# Altium project S7CAS-PLEIADES-CARTE-MERE_P06.PrjPcb (part 3 of 4)

## Sheet S7CAS-PLEIADES-CARTE-MERE_P06_DDR3.SCHDOC
size Tabloid; SheetNumber: 12; SheetTotal: 18; Sheet_Name: DDR3; Size: 11x17
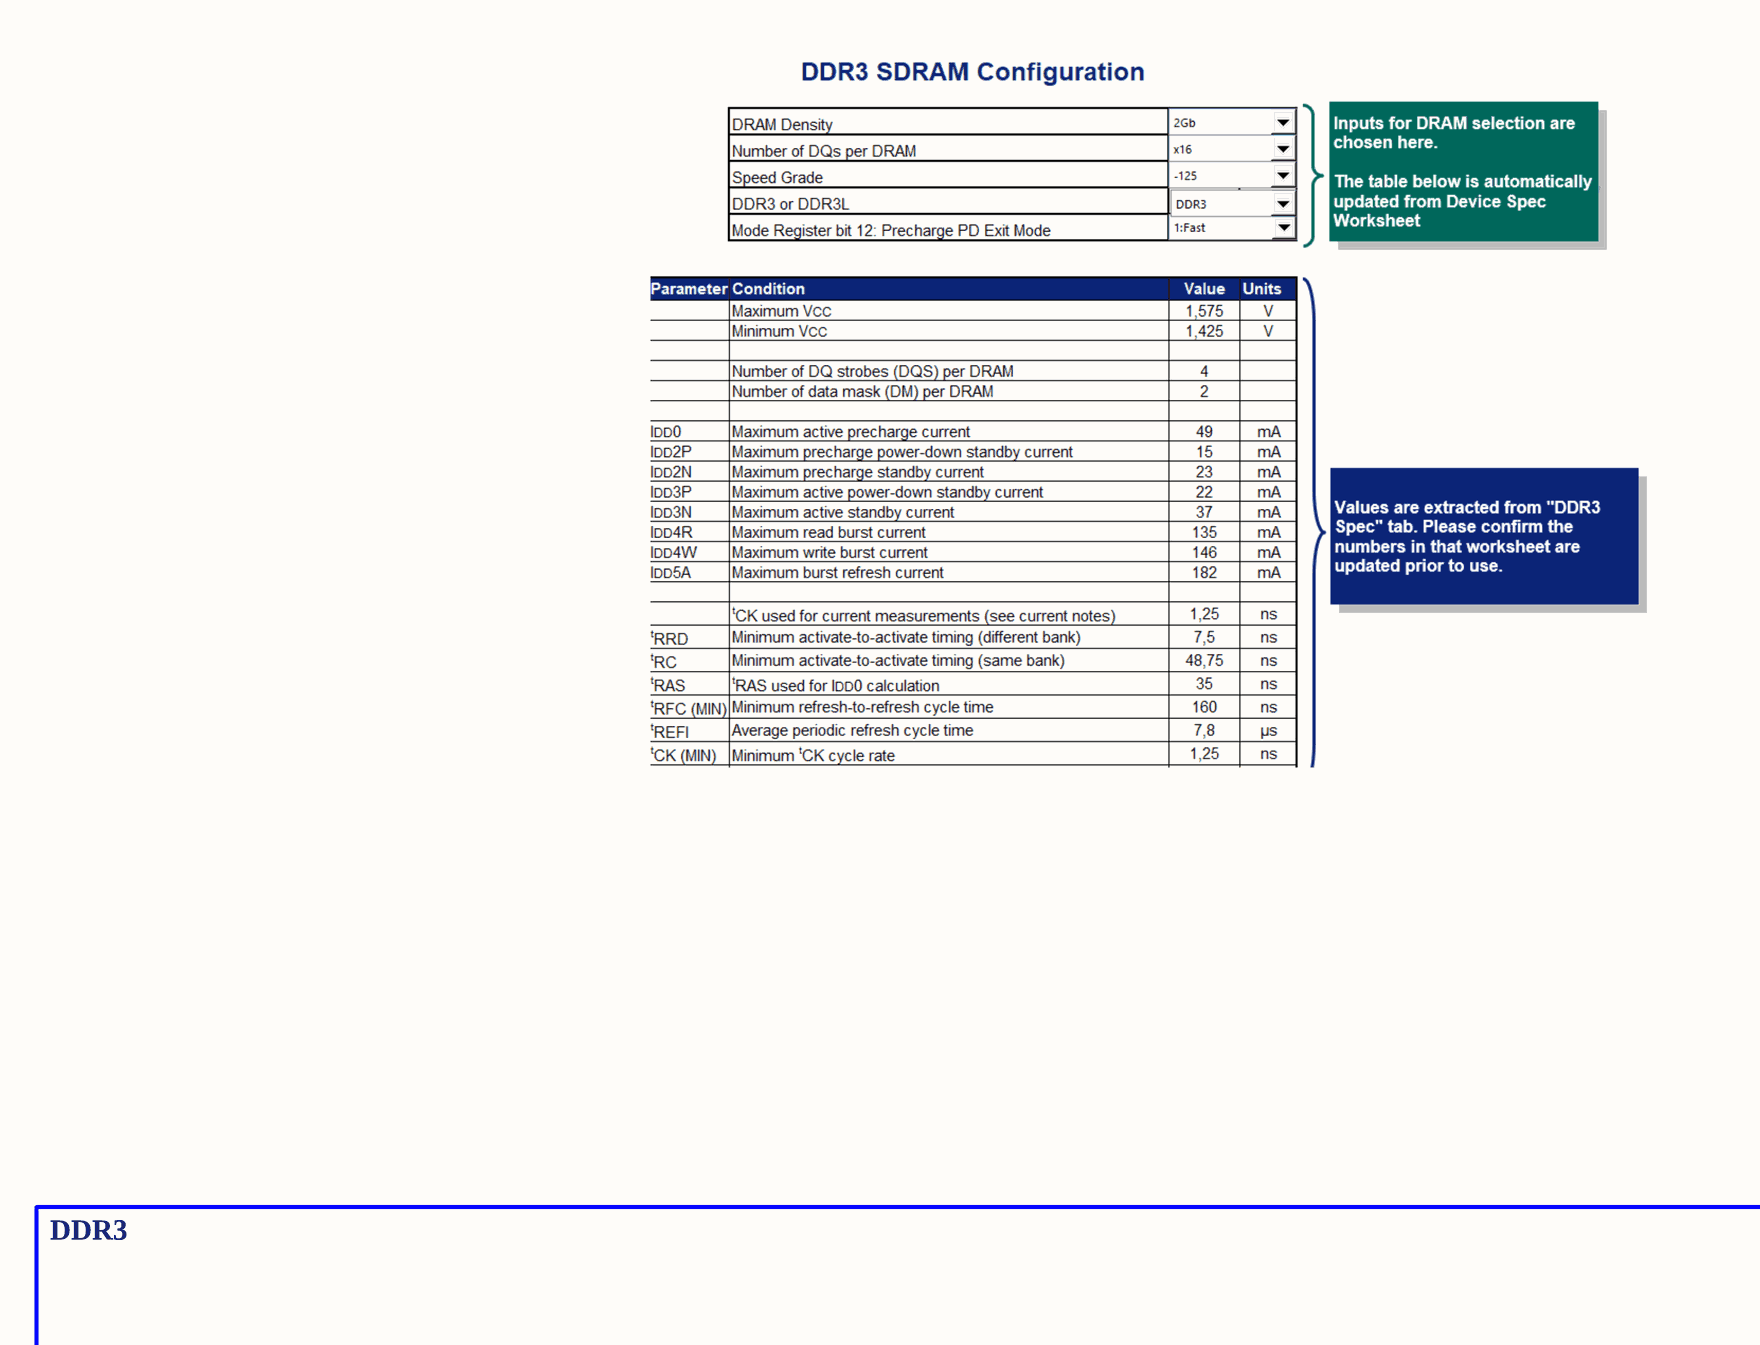
[diagram p34: S7CAS-PLEIADES-CARTE-MERE_P06_DDR3.SCHDOC, top left]
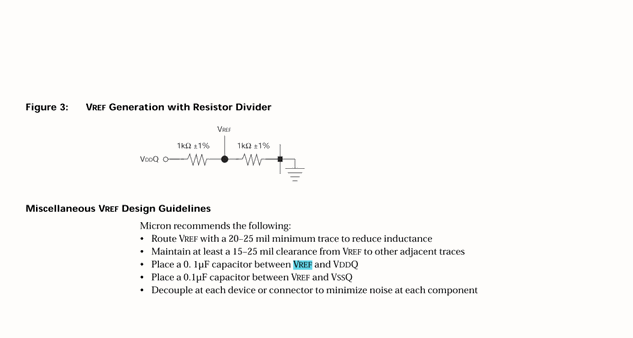
[diagram p35: S7CAS-PLEIADES-CARTE-MERE_P06_DDR3.SCHDOC, top right]
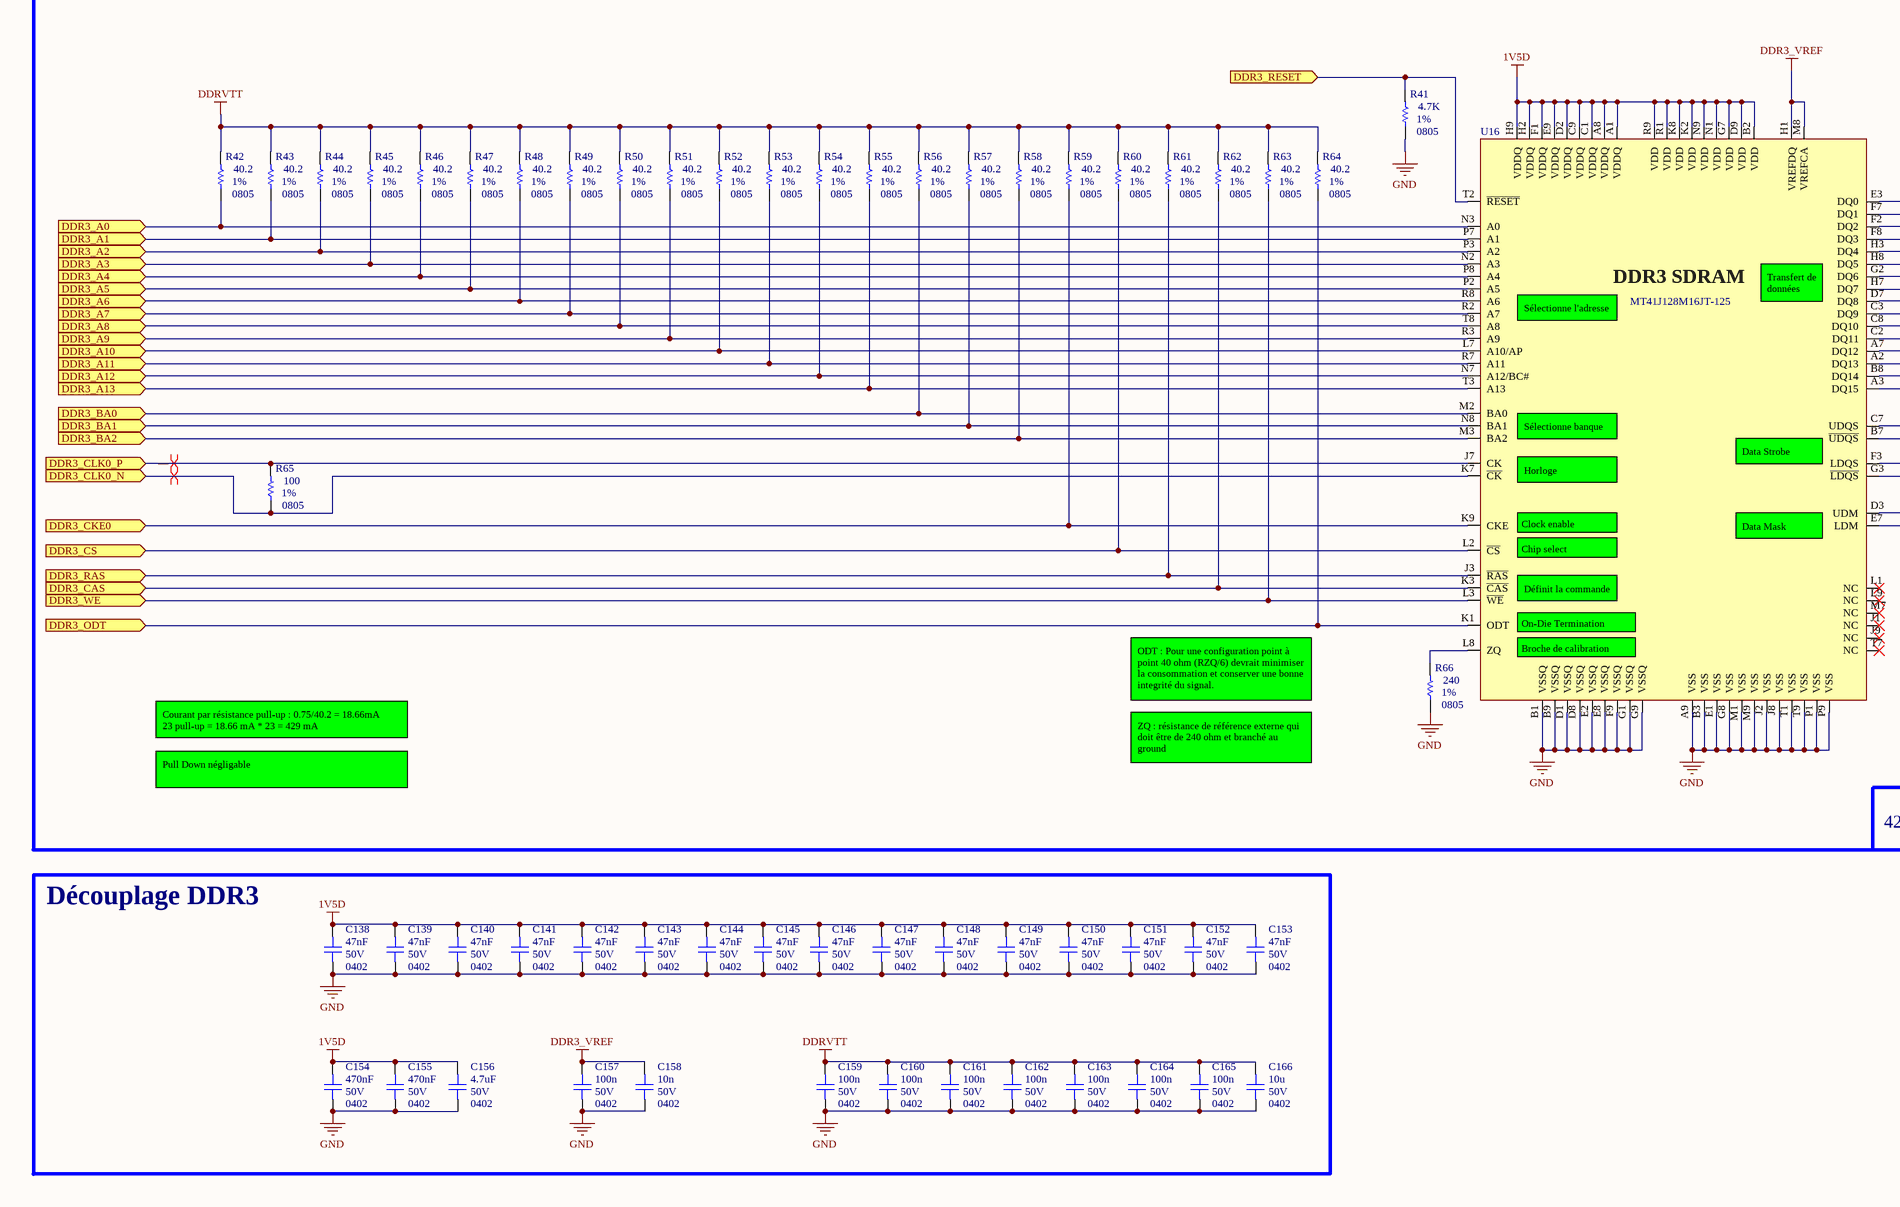
[diagram p36: S7CAS-PLEIADES-CARTE-MERE_P06_DDR3.SCHDOC, bottom left]
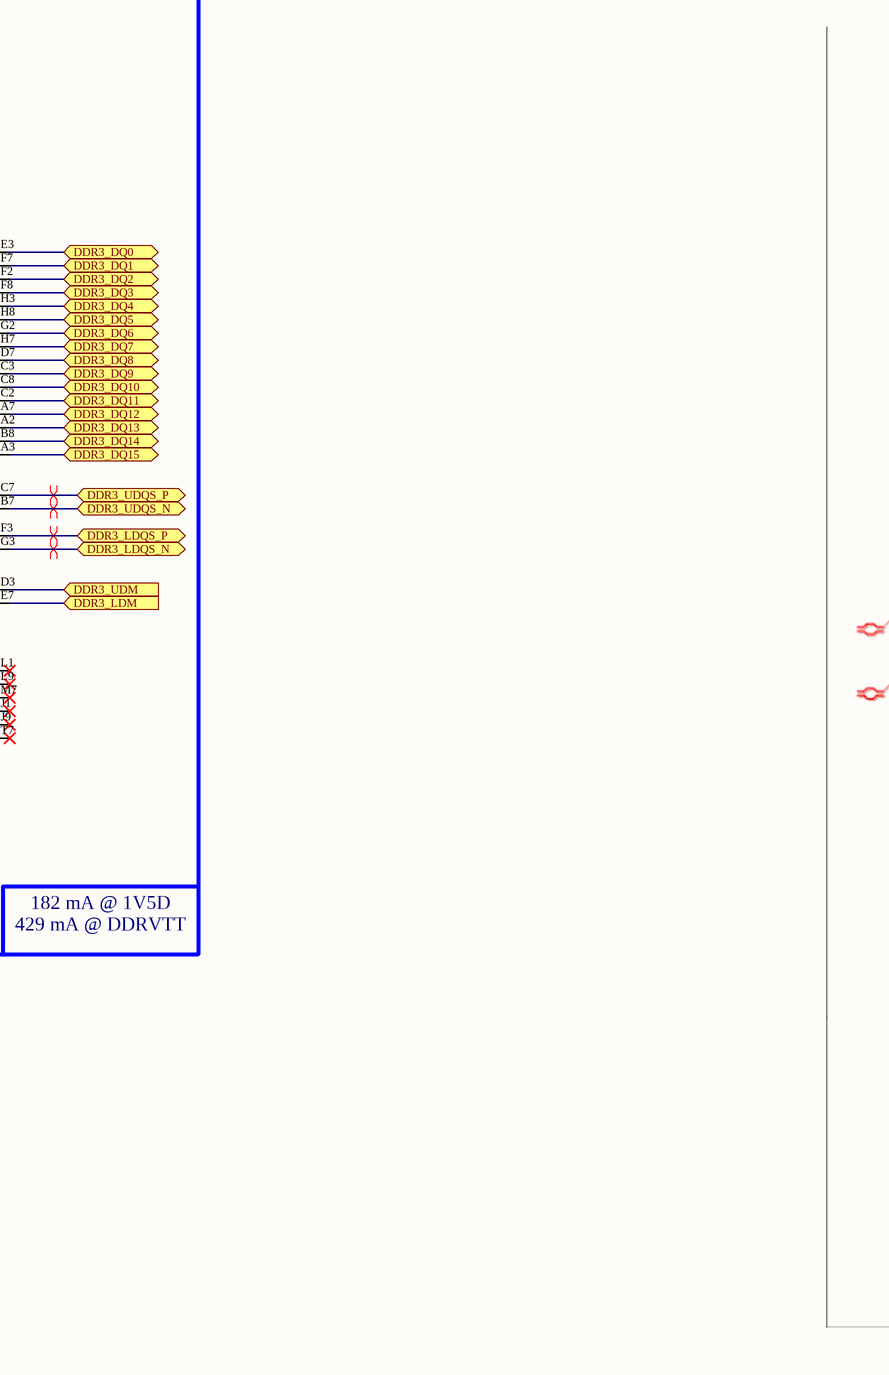
[diagram p37: S7CAS-PLEIADES-CARTE-MERE_P06_DDR3.SCHDOC, bottom middle]
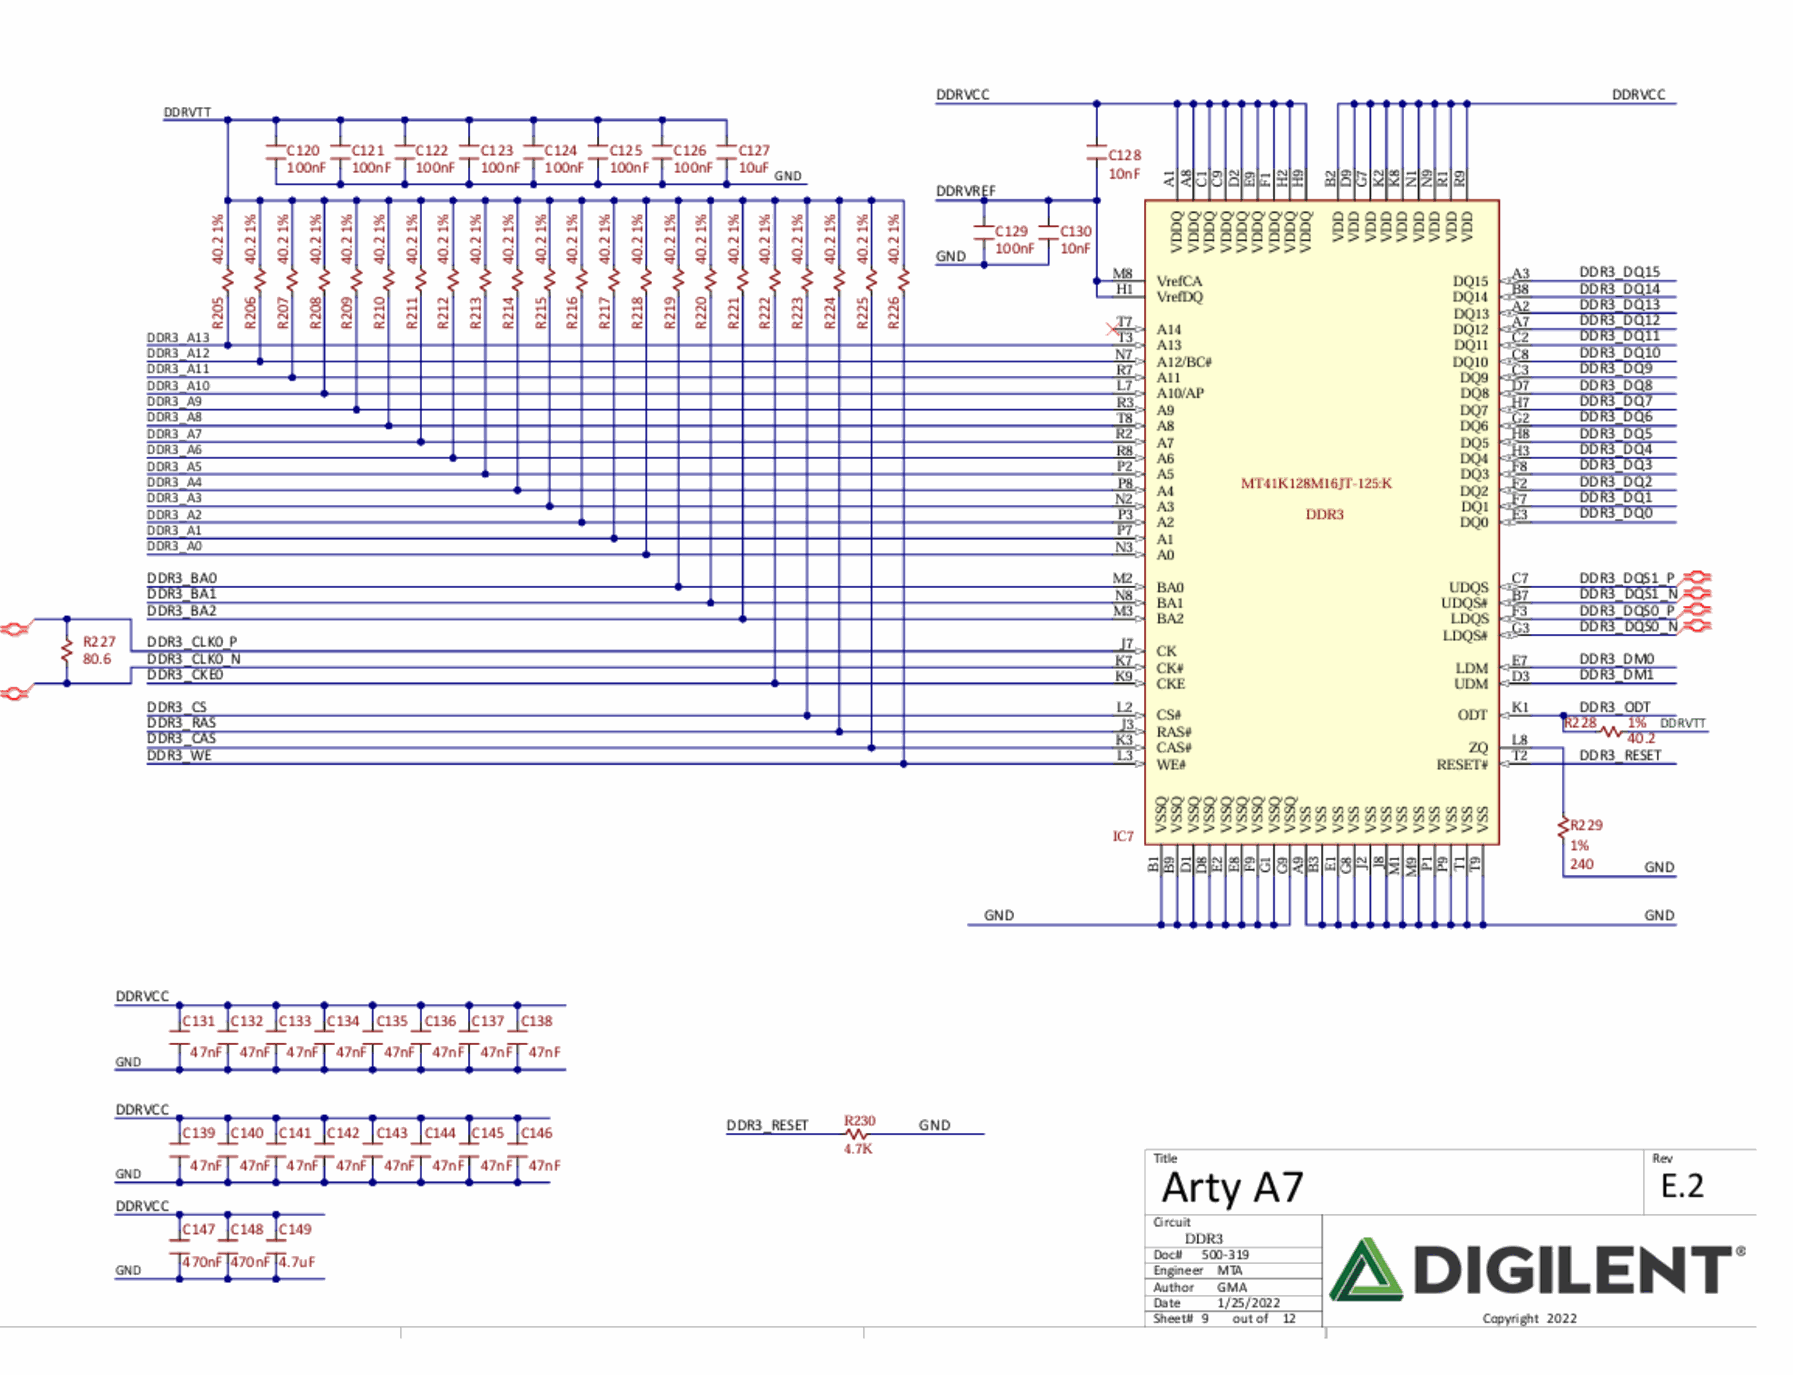
[diagram p38: S7CAS-PLEIADES-CARTE-MERE_P06_DDR3.SCHDOC, bottom right]

### Parts
C138  value 47nF  Voltage: 50V  Package: 0402  [CAP_0402]  (hidden comment: CAP - 0402)
C139  value 47nF  Voltage: 50V  Package: 0402  [CAP_0402]  (hidden comment: CAP - 0402)
C140  value 47nF  Voltage: 50V  Package: 0402  [CAP_0402]  (hidden comment: CAP - 0402)
C141  value 47nF  Voltage: 50V  Package: 0402  [CAP_0402]  (hidden comment: CAP - 0402)
C142  value 47nF  Voltage: 50V  Package: 0402  [CAP_0402]  (hidden comment: CAP - 0402)
C143  value 47nF  Voltage: 50V  Package: 0402  [CAP_0402]  (hidden comment: CAP - 0402)
C144  value 47nF  Voltage: 50V  Package: 0402  [CAP_0402]  (hidden comment: CAP - 0402)
C145  value 47nF  Voltage: 50V  Package: 0402  [CAP_0402]  (hidden comment: CAP - 0402)
C146  value 47nF  Voltage: 50V  Package: 0402  [CAP_0402]  (hidden comment: CAP - 0402)
C147  value 47nF  Voltage: 50V  Package: 0402  [CAP_0402]  (hidden comment: CAP - 0402)
C148  value 47nF  Voltage: 50V  Package: 0402  [CAP_0402]  (hidden comment: CAP - 0402)
C149  value 47nF  Voltage: 50V  Package: 0402  [CAP_0402]  (hidden comment: CAP - 0402)
C150  value 47nF  Voltage: 50V  Package: 0402  [CAP_0402]  (hidden comment: CAP - 0402)
C151  value 47nF  Voltage: 50V  Package: 0402  [CAP_0402]  (hidden comment: CAP - 0402)
C152  value 47nF  Voltage: 50V  Package: 0402  [CAP_0402]  (hidden comment: CAP - 0402)
C153  value 47nF  Voltage: 50V  Package: 0402  [CAP_0402]  (hidden comment: CAP - 0402)
C154  value 470nF  Voltage: 50V  Package: 0402  [CAP_0402]  (hidden comment: CAP - 0402)
C155  value 470nF  Voltage: 50V  Package: 0402  [CAP_0402]  (hidden comment: CAP - 0402)
C156  value 4.7uF  Voltage: 50V  Package: 0402  [CAP_0402]  (hidden comment: CAP - 0402)
C157  value 100n  Voltage: 50V  Package: 0402  [CAP_0402]  (hidden comment: CAP - 0402)
C158  value 10n  Voltage: 50V  Package: 0402  [CAP_0402]  (hidden comment: CAP - 0402)
C159  value 100n  Voltage: 50V  Package: 0402  [CAP_0402]  (hidden comment: CAP - 0402)
C160  value 100n  Voltage: 50V  Package: 0402  [CAP_0402]  (hidden comment: CAP - 0402)
C161  value 100n  Voltage: 50V  Package: 0402  [CAP_0402]  (hidden comment: CAP - 0402)
C162  value 100n  Voltage: 50V  Package: 0402  [CAP_0402]  (hidden comment: CAP - 0402)
C163  value 100n  Voltage: 50V  Package: 0402  [CAP_0402]  (hidden comment: CAP - 0402)
C164  value 100n  Voltage: 50V  Package: 0402  [CAP_0402]  (hidden comment: CAP - 0402)
C165  value 100n  Voltage: 50V  Package: 0402  [CAP_0402]  (hidden comment: CAP - 0402)
C166  value 10u  Voltage: 50V  Package: 0402  [CAP_0402]  (hidden comment: CAP - 0402)
R41  value 4.7K  Package: 0805  Precision: 1%  [RES_0805]  (hidden comment: RES - 0805)
R42  value 40.2  Package: 0805  Precision: 1%  [RES_0805]  (hidden comment: RES - 0805)
R43  value 40.2  Package: 0805  Precision: 1%  [RES_0805]  (hidden comment: RES - 0805)
R44  value 40.2  Package: 0805  Precision: 1%  [RES_0805]  (hidden comment: RES - 0805)
R45  value 40.2  Package: 0805  Precision: 1%  [RES_0805]  (hidden comment: RES - 0805)
R46  value 40.2  Package: 0805  Precision: 1%  [RES_0805]  (hidden comment: RES - 0805)
R47  value 40.2  Package: 0805  Precision: 1%  [RES_0805]  (hidden comment: RES - 0805)
R48  value 40.2  Package: 0805  Precision: 1%  [RES_0805]  (hidden comment: RES - 0805)
R49  value 40.2  Package: 0805  Precision: 1%  [RES_0805]  (hidden comment: RES - 0805)
R50  value 40.2  Package: 0805  Precision: 1%  [RES_0805]  (hidden comment: RES - 0805)
R51  value 40.2  Package: 0805  Precision: 1%  [RES_0805]  (hidden comment: RES - 0805)
R52  value 40.2  Package: 0805  Precision: 1%  [RES_0805]  (hidden comment: RES - 0805)
R53  value 40.2  Package: 0805  Precision: 1%  [RES_0805]  (hidden comment: RES - 0805)
R54  value 40.2  Package: 0805  Precision: 1%  [RES_0805]  (hidden comment: RES - 0805)
R55  value 40.2  Package: 0805  Precision: 1%  [RES_0805]  (hidden comment: RES - 0805)
R56  value 40.2  Package: 0805  Precision: 1%  [RES_0805]  (hidden comment: RES - 0805)
R57  value 40.2  Package: 0805  Precision: 1%  [RES_0805]  (hidden comment: RES - 0805)
R58  value 40.2  Package: 0805  Precision: 1%  [RES_0805]  (hidden comment: RES - 0805)
R59  value 40.2  Package: 0805  Precision: 1%  [RES_0805]  (hidden comment: RES - 0805)
R60  value 40.2  Package: 0805  Precision: 1%  [RES_0805]  (hidden comment: RES - 0805)
R61  value 40.2  Package: 0805  Precision: 1%  [RES_0805]  (hidden comment: RES - 0805)
R62  value 40.2  Package: 0805  Precision: 1%  [RES_0805]  (hidden comment: RES - 0805)
R63  value 40.2  Package: 0805  Precision: 1%  [RES_0805]  (hidden comment: RES - 0805)
R64  value 40.2  Package: 0805  Precision: 1%  [RES_0805]  (hidden comment: RES - 0805)
R65  value 100  Package: 0805  Precision: 1%  [RES_0805]  (hidden comment: RES - 0805)
R66  value 240  Package: 0805  Precision: 1%  [RES_0805]  (hidden comment: RES - 0805)
U16  MT41J128M16JT-125  [MEM_DDR3_MT41J128M16JT-125]

### Blocks framed on the sheet
DDR3: R41-R66 U16
Découplage DDR3: C138-C166

### Ports
DDR3_A0 (in, see S7CAS-PLEIADES-CARTE-MERE_P06_FPGA2[6B]), DDR3_A1 (in, see S7CAS-PLEIADES-CARTE-MERE_P06_FPGA2[6B]), DDR3_A2 (in, see S7CAS-PLEIADES-CARTE-MERE_P06_FPGA2[6B]), DDR3_A3 (in, see S7CAS-PLEIADES-CARTE-MERE_P06_FPGA2[6B]), DDR3_A4 (in, see S7CAS-PLEIADES-CARTE-MERE_P06_FPGA2[6B]), DDR3_A5 (in, see S7CAS-PLEIADES-CARTE-MERE_P06_FPGA2[6B]), DDR3_A6 (in, see S7CAS-PLEIADES-CARTE-MERE_P06_FPGA2[6B]), DDR3_A7 (in, see S7CAS-PLEIADES-CARTE-MERE_P06_FPGA2[6B]), DDR3_A8 (in, see S7CAS-PLEIADES-CARTE-MERE_P06_FPGA2[6B]), DDR3_A9 (in, see S7CAS-PLEIADES-CARTE-MERE_P06_FPGA2[6B]), DDR3_A10 (in, see S7CAS-PLEIADES-CARTE-MERE_P06_FPGA2[6B]), DDR3_A11 (in, see S7CAS-PLEIADES-CARTE-MERE_P06_FPGA2[6C]), DDR3_A12 (in, see S7CAS-PLEIADES-CARTE-MERE_P06_FPGA2[6C]), DDR3_A13 (in, see S7CAS-PLEIADES-CARTE-MERE_P06_FPGA2[6C]), DDR3_BA0 (in, see S7CAS-PLEIADES-CARTE-MERE_P06_FPGA2[6B]), DDR3_BA1 (in, see S7CAS-PLEIADES-CARTE-MERE_P06_FPGA2[6B]), DDR3_BA2 (in, see S7CAS-PLEIADES-CARTE-MERE_P06_FPGA2[6B]), DDR3_CAS (in, see S7CAS-PLEIADES-CARTE-MERE_P06_FPGA2[6B]), DDR3_CKE0 (in, see S7CAS-PLEIADES-CARTE-MERE_P06_FPGA2[6B]), DDR3_CLK0_N (in, see S7CAS-PLEIADES-CARTE-MERE_P06_FPGA2[6B]), DDR3_CLK0_P (in, see S7CAS-PLEIADES-CARTE-MERE_P06_FPGA2[6B]), DDR3_CS (in, see S7CAS-PLEIADES-CARTE-MERE_P06_FPGA2[6C]), DDR3_DQ0 (bidir, see S7CAS-PLEIADES-CARTE-MERE_P06_FPGA2[6A]), DDR3_DQ1 (bidir, see S7CAS-PLEIADES-CARTE-MERE_P06_FPGA2[6A]), DDR3_DQ2 (bidir, see S7CAS-PLEIADES-CARTE-MERE_P06_FPGA2[6A]), DDR3_DQ3 (bidir, see S7CAS-PLEIADES-CARTE-MERE_P06_FPGA2[6A]), DDR3_DQ4 (bidir, see S7CAS-PLEIADES-CARTE-MERE_P06_FPGA2[6B]), DDR3_DQ5 (bidir, see S7CAS-PLEIADES-CARTE-MERE_P06_FPGA2[6B]), DDR3_DQ6 (bidir, see S7CAS-PLEIADES-CARTE-MERE_P06_FPGA2[6B]), DDR3_DQ7 (bidir, see S7CAS-PLEIADES-CARTE-MERE_P06_FPGA2[6B]), DDR3_DQ8 (bidir, see S7CAS-PLEIADES-CARTE-MERE_P06_FPGA2[6A]), DDR3_DQ9 (bidir, see S7CAS-PLEIADES-CARTE-MERE_P06_FPGA2[6A]), DDR3_DQ10 (bidir, see S7CAS-PLEIADES-CARTE-MERE_P06_FPGA2[6A]), DDR3_DQ11 (bidir, see S7CAS-PLEIADES-CARTE-MERE_P06_FPGA2[6A]), DDR3_DQ12 (bidir, see S7CAS-PLEIADES-CARTE-MERE_P06_FPGA2[6A]), DDR3_DQ13 (bidir, see S7CAS-PLEIADES-CARTE-MERE_P06_FPGA2[6A]), DDR3_DQ14 (bidir, see S7CAS-PLEIADES-CARTE-MERE_P06_FPGA2[4C]), DDR3_DQ15 (bidir, see S7CAS-PLEIADES-CARTE-MERE_P06_FPGA2[6A]), DDR3_LDM (in, see S7CAS-PLEIADES-CARTE-MERE_P06_FPGA2[6B]), DDR3_LDQS_N (bidir, see S7CAS-PLEIADES-CARTE-MERE_P06_FPGA2[6B]), DDR3_LDQS_P (bidir, see S7CAS-PLEIADES-CARTE-MERE_P06_FPGA2[6A]), DDR3_ODT (in, see S7CAS-PLEIADES-CARTE-MERE_P06_FPGA2[6B]), DDR3_RAS (in, see S7CAS-PLEIADES-CARTE-MERE_P06_FPGA2[6B]), DDR3_RESET (in, see S7CAS-PLEIADES-CARTE-MERE_P06_FPGA2[6C]), DDR3_UDM (in, see S7CAS-PLEIADES-CARTE-MERE_P06_FPGA2[6B]), DDR3_UDQS_N (bidir, see S7CAS-PLEIADES-CARTE-MERE_P06_FPGA2[6A]), DDR3_UDQS_P (bidir, see S7CAS-PLEIADES-CARTE-MERE_P06_FPGA2[6A]), DDR3_WE (in, see S7CAS-PLEIADES-CARTE-MERE_P06_FPGA2[6B])

### Nets
1V5D: C138.2 C139.2 C140.2 C141.2 C142.2 C143.2 C144.2 C145.2 C146.2 C147.2 C148.2 C149.2 C150.2 C151.2 C152.2 C153.2 C154.2 C155.2 C156.2 U16.A1(VDDQ) U16.A8(VDDQ) U16.B2(VDD) U16.C1(VDDQ) U16.C9(VDDQ) U16.D2(VDDQ) U16.D9(VDD) U16.E9(VDDQ) U16.F1(VDDQ) U16.G7(VDD) U16.H2(VDDQ) U16.H9(VDDQ) U16.K2(VDD) U16.K8(VDD) U16.N1(VDD) U16.N9(VDD) U16.R1(VDD) U16.R9(VDD)
DDR3_VREF: C157.2 C158.2 U16.H1(VREFDQ) U16.M8(VREFCA)
DDRVTT: C159.2 C160.2 C161.2 C162.2 C163.2 C164.2 C165.2 C166.2 R42.2 R43.2 R44.2 R45.2 R46.2 R47.2 R48.2 R49.2 R50.2 R51.2 R52.2 R53.2 R54.2 R55.2 R56.2 R57.2 R58.2 R59.2 R60.2 R61.2 R62.2 R63.2 R64.2
GND: C138.1 C139.1 C140.1 C141.1 C142.1 C143.1 C144.1 C145.1 C146.1 C147.1 C148.1 C149.1 C150.1 C151.1 C152.1 C153.1 C154.1 C155.1 C156.1 C157.1 C158.1 C159.1 C160.1 C161.1 C162.1 C163.1 C164.1 C165.1 C166.1 R41.1 R66.1 U16.A9(VSS) U16.B1(VSSQ) U16.B3(VSS) U16.B9(VSSQ) U16.D1(VSSQ) U16.D8(VSSQ) U16.E1(VSS) U16.E2(VSSQ) U16.E8(VSSQ) U16.F9(VSSQ) U16.G1(VSSQ) U16.G8(VSS) U16.G9(VSSQ) U16.J2(VSS) U16.J8(VSS) U16.M1(VSS) U16.M9(VSS) U16.P1(VSS) U16.P9(VSS) U16.T1(VSS) U16.T9(VSS)
DDR3_A0: R42.1 U16.N3(A0) ; port DDR3_A0
DDR3_A1: R43.1 U16.P7(A1) ; port DDR3_A1
DDR3_A2: R44.1 U16.P3(A2) ; port DDR3_A2
DDR3_A3: R45.1 U16.N2(A3) ; port DDR3_A3
DDR3_A4: R46.1 U16.P8(A4) ; port DDR3_A4
DDR3_A5: R47.1 U16.P2(A5) ; port DDR3_A5
DDR3_A6: R48.1 U16.R8(A6) ; port DDR3_A6
DDR3_A7: R49.1 U16.R2(A7) ; port DDR3_A7
DDR3_A8: R50.1 U16.T8(A8) ; port DDR3_A8
DDR3_A9: R51.1 U16.R3(A9) ; port DDR3_A9
DDR3_A10: R52.1 U16.L7(A10/AP) ; port DDR3_A10
DDR3_A11: R53.1 U16.R7(A11) ; port DDR3_A11
DDR3_A12: R54.1 U16.N7(A12/BC#) ; port DDR3_A12
DDR3_A13: R55.1 U16.T3(A13) ; port DDR3_A13
DDR3_BA0: R56.1 U16.M2(BA0) ; port DDR3_BA0
DDR3_BA1: R57.1 U16.N8(BA1) ; port DDR3_BA1
DDR3_BA2: R58.1 U16.M3(BA2) ; port DDR3_BA2
DDR3_CAS: R62.1 U16.K3(~{CAS}) ; port DDR3_CAS
DDR3_CKE0: R59.1 U16.K9(CKE) ; port DDR3_CKE0
DDR3_CLK0_N: R65.1 U16.K7(~{CK}) ; port DDR3_CLK0_N
DDR3_CLK0_P: R65.2 U16.J7(CK) ; port DDR3_CLK0_P
DDR3_CS: R60.1 U16.L2(~{CS}) ; port DDR3_CS
DDR3_DQ0: U16.E3(DQ0) ; port DDR3_DQ0
DDR3_DQ1: U16.F7(DQ1) ; port DDR3_DQ1
DDR3_DQ2: U16.F2(DQ2) ; port DDR3_DQ2
DDR3_DQ3: U16.F8(DQ3) ; port DDR3_DQ3
DDR3_DQ4: U16.H3(DQ4) ; port DDR3_DQ4
DDR3_DQ5: U16.H8(DQ5) ; port DDR3_DQ5
DDR3_DQ6: U16.G2(DQ6) ; port DDR3_DQ6
DDR3_DQ7: U16.H7(DQ7) ; port DDR3_DQ7
DDR3_DQ8: U16.D7(DQ8) ; port DDR3_DQ8
DDR3_DQ9: U16.C3(DQ9) ; port DDR3_DQ9
DDR3_DQ10: U16.C8(DQ10) ; port DDR3_DQ10
DDR3_DQ11: U16.C2(DQ11) ; port DDR3_DQ11
DDR3_DQ12: U16.A7(DQ12) ; port DDR3_DQ12
DDR3_DQ13: U16.A2(DQ13) ; port DDR3_DQ13
DDR3_DQ14: U16.B8(DQ14) ; port DDR3_DQ14
DDR3_DQ15: U16.A3(DQ15) ; port DDR3_DQ15
DDR3_LDM: U16.E7(LDM) ; port DDR3_LDM
DDR3_LDQS_N: U16.G3(~{LDQS}) ; port DDR3_LDQS_N
DDR3_LDQS_P: U16.F3(LDQS) ; port DDR3_LDQS_P
DDR3_ODT: R64.1 U16.K1(ODT) ; port DDR3_ODT
DDR3_RAS: R61.1 U16.J3(~{RAS}) ; port DDR3_RAS
DDR3_RESET: R41.2 U16.T2(~{RESET}) ; port DDR3_RESET
DDR3_UDM: U16.D3(UDM) ; port DDR3_UDM
DDR3_UDQS_N: U16.B7(~{UDQS}) ; port DDR3_UDQS_N
DDR3_UDQS_P: U16.C7(UDQS) ; port DDR3_UDQS_P
DDR3_WE: R63.1 U16.L3(~{WE}) ; port DDR3_WE
NetR66_2: R66.2 U16.L8(ZQ)

Not connected (* = marked no-connect by the designer): U16 J1(NC)* J9(NC)* L1(NC)* L9(NC)* M7(NC)* T7(NC)*

### Layout directives
differential pair: DDR3_CLK0_N, DDR3_CLK0_P, DDR3_LDQS_N, DDR3_LDQS_P, DDR3_UDQS_N, DDR3_UDQS_P

### Notes on the sheet
- (near U16) Transfert de données
- (near U16) Sélectionne l'adresse
- (near U16) Sélectionne banque
- (near U16) Horloge
- (near U16) Data Strobe
- (near U16) Clock enable
- (near U16) Chip select
- (near U16) Data Mask
- (near U16) Définit la commande
- (near U16) On-Die Termination
- (near U16) Broche de calibration externe
- Courant par résistance pull-up : 0.75/40.2 = 18.66mA
  23 pull-up = 18.66 mA * 23 = 429 mA
- ODT : Pour une configuration point à point 40 ohm (RZQ/6) devrait minimiser la consommation et conserver une bonne integrité du signal.
- Pull Down négligable
- ZQ : résistance de référence externe qui doit être de 240 ohm et branché au ground
- 182 mA @ 1V5D
  429 mA @ DDRVTT
- Sheet Name
- Project Title
- Global Project
- Size
- Group
- Revision
- Date
- Sheet
- of
- Filename
- Designers
- (in symbol MEM_DDR3_MT41J128M16JT-125:K TR) DDR3 SDRAM

### Library data of the parts
C138-C166 = CAP - 0402: Precision: 10%; Current: *; CreatedBy: Jonathan Bouchard; Power: *
U16 = MEM_DDR3_MT41J128M16JT-125:K TR: MEM - DDR3 SDRAM 2GBIT 800MHZ - TFBGA-96; Voltage: 1.425 V ~ 1.575 V; Mfg: Micrel; Current: *; Power: *; Mfg Part Number: MT41J128M16JT-125; HelpURL: http://www.micron.com/~/media/Documents/Products/Data%20Sheet/DRAM/DDR3/2Gb_DDR3_SDRAM.pdf; CreatedBy: Jonathan Bouchard; Temperature: 0°C ~ 95°C (TC); Value: *; Precision: *; Package: TFBGA-96; Supplier 1: Digikey; Supplier Part Number 1: 557-1611-1-ND
R41-R66 = RES - 0805: Current: *; CreatedBy: Jonathan Bouchard

## Sheet S7CAS-PLEIADES-CARTE-MERE_P06_MOTOR.SCHDOC
size Tabloid; SheetNumber: 13; SheetTotal: 18; Sheet_Name: MOTOR; Size: 11x17
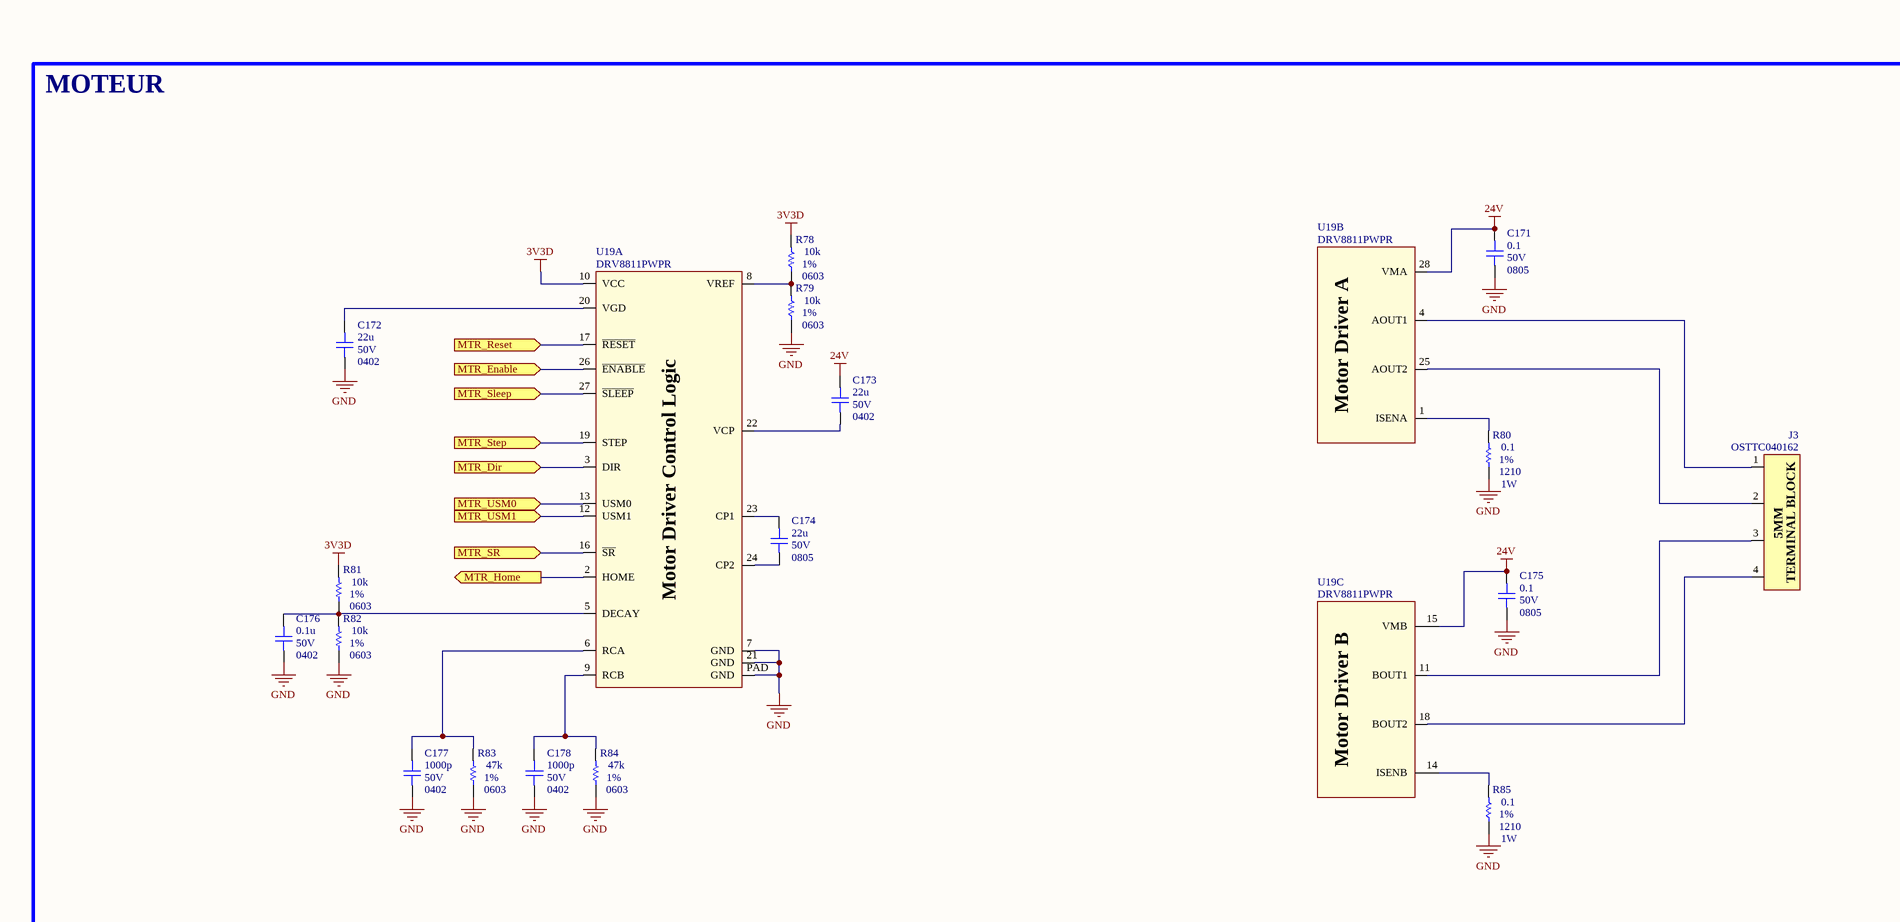
[diagram p39: S7CAS-PLEIADES-CARTE-MERE_P06_MOTOR.SCHDOC, top left]
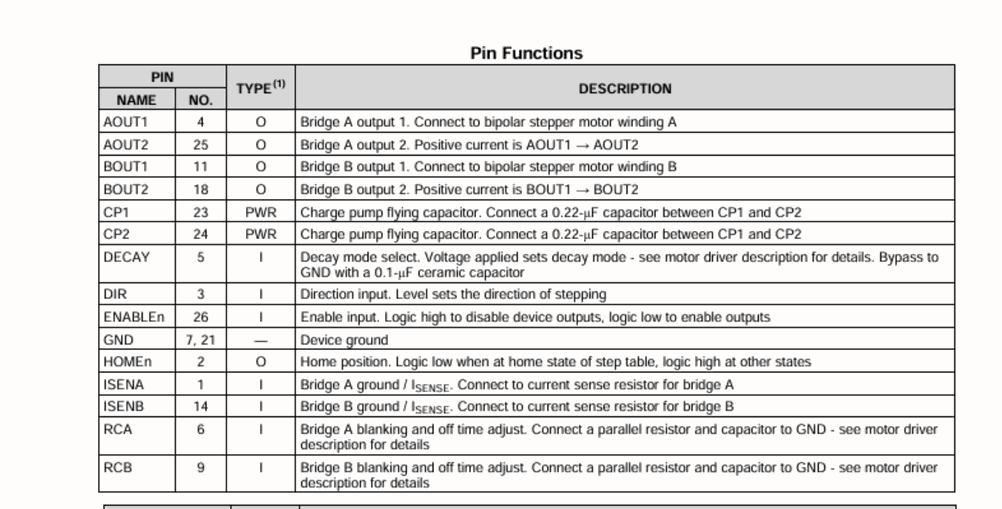
[diagram p40: S7CAS-PLEIADES-CARTE-MERE_P06_MOTOR.SCHDOC, top right]
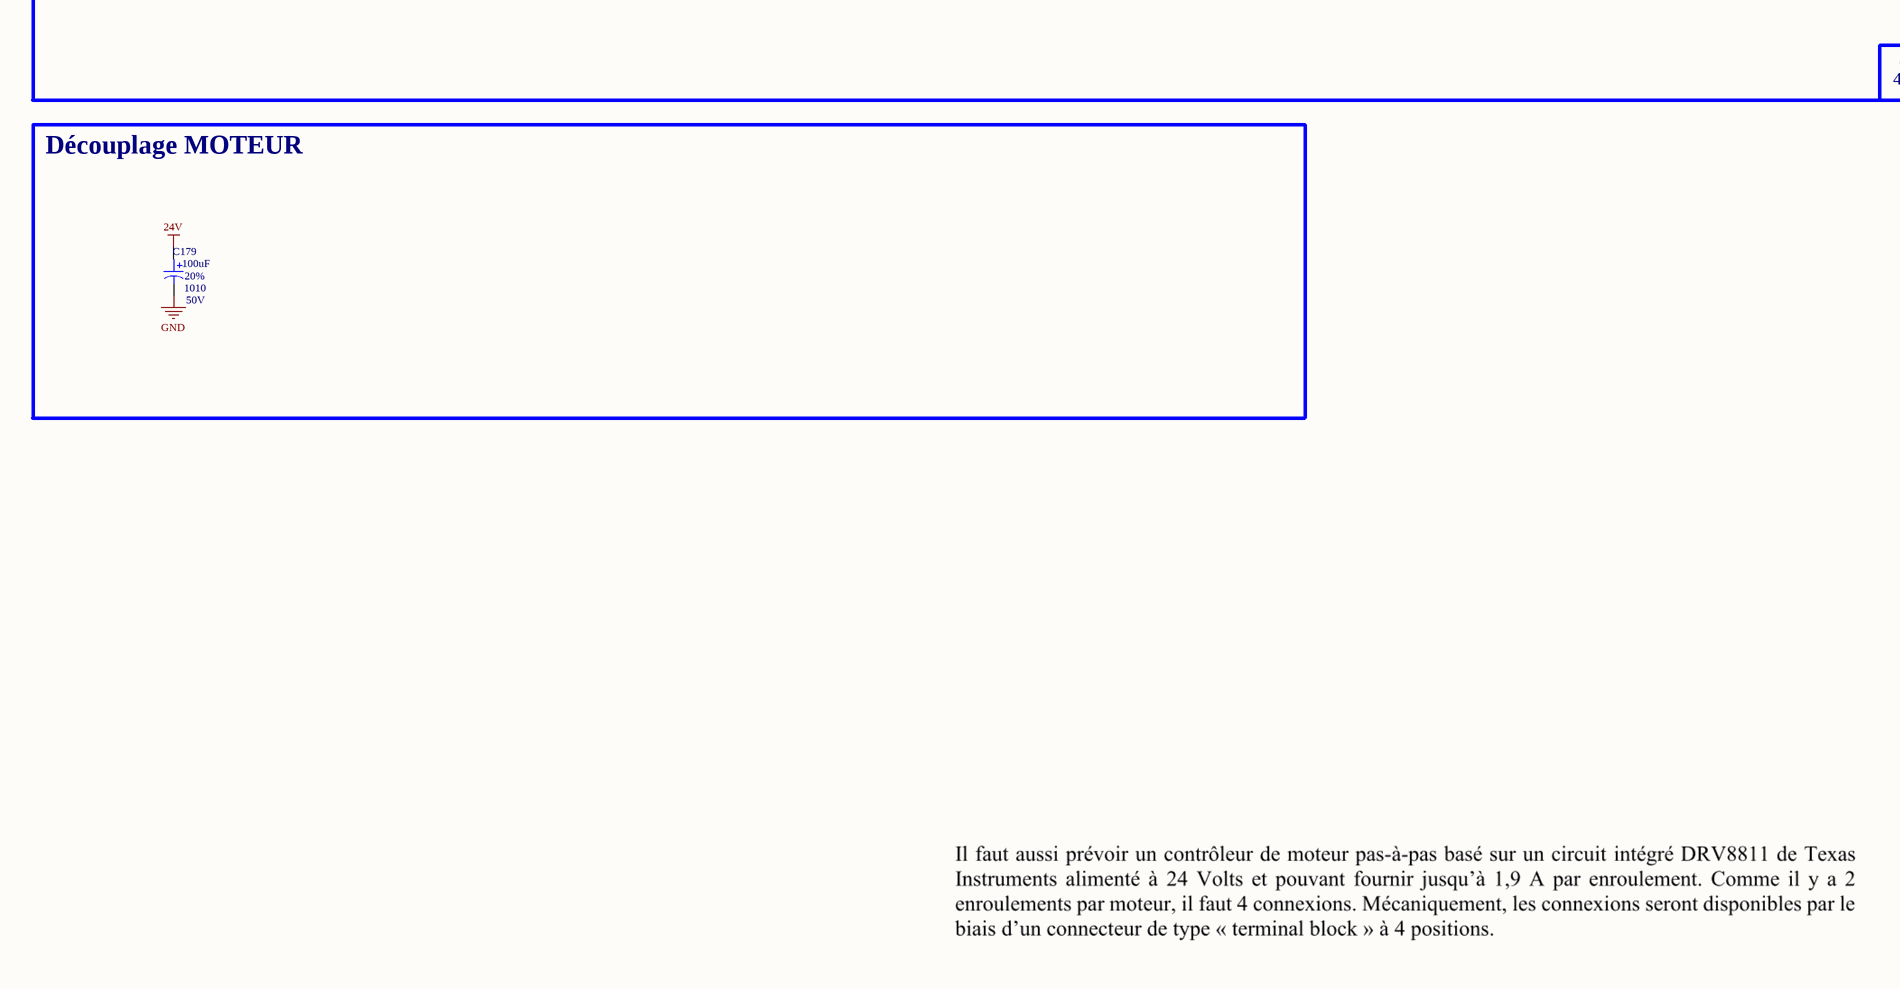
[diagram p41: S7CAS-PLEIADES-CARTE-MERE_P06_MOTOR.SCHDOC, bottom left]
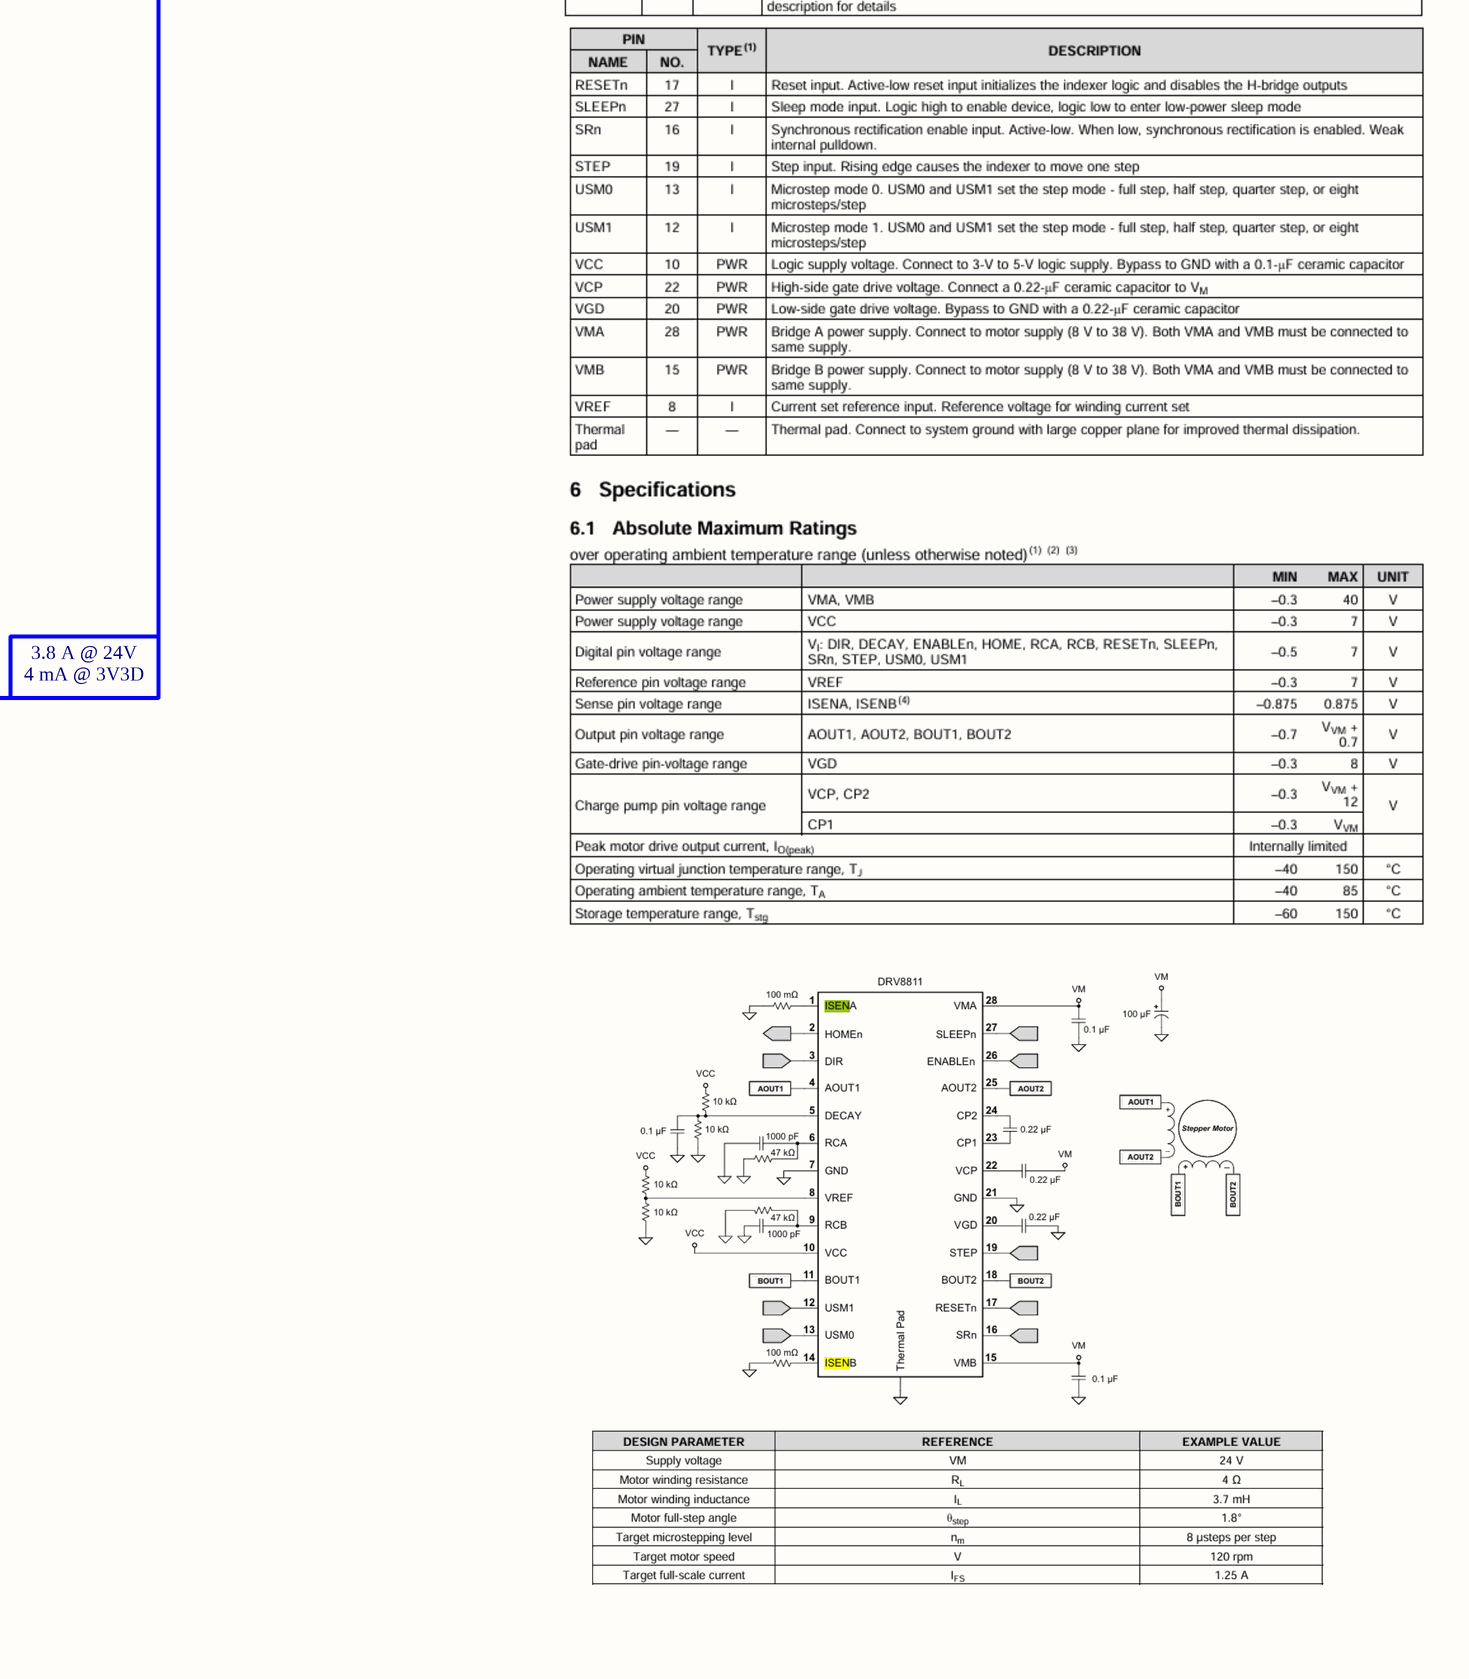
[diagram p42: S7CAS-PLEIADES-CARTE-MERE_P06_MOTOR.SCHDOC, bottom right]

### Parts
C171  value 0.1  Voltage: 50V  Package: 0805  [CAP_0805]  (hidden comment: CAP - 0805)
C172  value 22u  Voltage: 50V  Package: 0402  [CAP_0402]  (hidden comment: CAP - 0402)
C173  value 22u  Voltage: 50V  Package: 0402  [CAP_0402]  (hidden comment: CAP - 0402)
C174  value 22u  Voltage: 50V  Package: 0805  [CAP_0805]  (hidden comment: CAP - 0805)
C175  value 0.1  Voltage: 50V  Package: 0805  [CAP_0805]  (hidden comment: CAP - 0805)
C176  value 0.1u  Voltage: 50V  Package: 0402  [CAP_0402]  (hidden comment: CAP - 0402)
C177  value 1000p  Voltage: 50V  Package: 0402  [CAP_0402]  (hidden comment: CAP - 0402)
C178  value 1000p  Voltage: 50V  Package: 0402  [CAP_0402]  (hidden comment: CAP - 0402)
C179  value 100uF  Voltage: 50V  Package: 1010  Precision: 20%  [CAP_ALU_1010_vishay]  (hidden comment: MAL215099101E3)
J3  OSTTC040162  [CONN_TERMINAL_OSTTA040161]
R78  value 10k  Package: 0603  Precision: 1%  [RES_0603]  (hidden comment: RES - 0603)
R79  value 10k  Package: 0603  Precision: 1%  [RES_0603]  (hidden comment: RES - 0603)
R80  value 0.1  Power: 1W  Package: 1210  Precision: 1%  [RES_1210]  (hidden comment: RES - 1210)
R81  value 10k  Package: 0603  Precision: 1%  [RES_0603]  (hidden comment: RES - 0603)
R82  value 10k  Package: 0603  Precision: 1%  [RES_0603]  (hidden comment: RES - 0603)
R83  value 47k  Package: 0603  Precision: 1%  [RES_0603]  (hidden comment: RES - 0603)
R84  value 47k  Package: 0603  Precision: 1%  [RES_0603]  (hidden comment: RES - 0603)
R85  value 0.1  Power: 1W  Package: 1210  Precision: 1%  [RES_1210]  (hidden comment: RES - 1210)
U19  DRV8811PWPR  [POW_MOTOR_DRV8811PWPR]  (parts A,B,C of 3)

### Blocks framed on the sheet
MOTEUR: C171-C178 J3 R78-R85 U19
Découplage MOTEUR: C179

### Ports
MTR_Dir (in, see S7CAS-PLEIADES-CARTE-MERE_P06_FPGA1[3B]), MTR_Enable (in, see S7CAS-PLEIADES-CARTE-MERE_P06_FPGA1[3A]), MTR_Home (out, see S7CAS-PLEIADES-CARTE-MERE_P06_FPGA1[3B]), MTR_Reset (in, see S7CAS-PLEIADES-CARTE-MERE_P06_FPGA1[3A]), MTR_Sleep (in, see S7CAS-PLEIADES-CARTE-MERE_P06_FPGA1[3A]), MTR_SR (in, see S7CAS-PLEIADES-CARTE-MERE_P06_FPGA1[3B]), MTR_Step (in, see S7CAS-PLEIADES-CARTE-MERE_P06_FPGA1[3A]), MTR_USM0 (in, see S7CAS-PLEIADES-CARTE-MERE_P06_FPGA1[3B]), MTR_USM1 (in, see S7CAS-PLEIADES-CARTE-MERE_P06_FPGA1[3B])

### Nets
3V3D: R78.2 R81.2 U19.10(VCC)
24V: C171.2 C173.2 C175.2 C179.1 U19.15(VMB) U19.28(VMA)
GND: C171.1 C172.1 C175.1 C176.1 C177.1 C178.1 C179.2 R79.1 R80.1 R82.1 R83.1 R84.1 R85.1 U19.7(GND) U19.21(GND) U19.PAD(GND)
MTR_Dir: U19.3(DIR) ; port MTR_Dir
MTR_Enable: U19.26(~{ENABLE}) ; port MTR_Enable
MTR_Home: U19.2(HOME) ; port MTR_Home
MTR_Reset: U19.17(~{RESET}) ; port MTR_Reset
MTR_Sleep: U19.27(~{SLEEP}) ; port MTR_Sleep
MTR_SR: U19.16(~{SR}) ; port MTR_SR
MTR_Step: U19.19(STEP) ; port MTR_Step
MTR_USM0: U19.13(USM0) ; port MTR_USM0
MTR_USM1: U19.12(USM1) ; port MTR_USM1
NetC172_2: C172.2 U19.20(VGD)
NetC173_1: C173.1 U19.22(VCP)
NetC174_1: C174.1 U19.24(CP2)
NetC174_2: C174.2 U19.23(CP1)
NetC176_2: C176.2 R81.1 R82.2 U19.5(DECAY)
NetC177_2: C177.2 R83.2 U19.6(RCA)
NetC178_2: C178.2 R84.2 U19.9(RCB)
NetJ3_1: J3.1 U19.4(AOUT1)
NetJ3_2: J3.2 U19.25(AOUT2)
NetJ3_3: J3.3 U19.11(BOUT1)
NetJ3_4: J3.4 U19.18(BOUT2)
NetR78_1: R78.1 R79.2 U19.8(VREF)
NetR80_2: R80.2 U19.1(ISENA)
NetR85_2: R85.2 U19.14(ISENB)

### Notes on the sheet
- 3.8 A @ 24V
  4 mA @ 3V3D
- Sheet Name
- Project Title
- Global Project
- Size
- Group
- Revision
- Date
- Sheet
- of
- Filename
- Designers
- (in symbol CONN_TERMINAL_OSTTC040162) 5MM; TERMINAL BLOCK
- (in symbol POW_MOTOR_DRV8811PWPR, part A) Motor Driver Control Logic
- (in symbol POW_MOTOR_DRV8811PWPR, part B) Motor Driver A
- (in symbol POW_MOTOR_DRV8811PWPR, part C) Motor Driver B

### Library data of the parts
C171 C174 C175 = CAP - 0805: Precision: 10%; Current: *; CreatedBy: Jonathan Bouchard; Power: *
C172 C173 C176-C178 = CAP - 0402: Precision: 10%; Current: *; CreatedBy: Jonathan Bouchard; Power: *
C179 = CAP_ALU_MAL215099101E3: CAP - ALU 100uF 20% 50V - 1010; Current: 490mA; Mfg: Vishay Dale; Mfg Part Number: MAL215099101E3; HelpURL: http://www.vishay.com/docs/28395/150crz.pdf; CreatedBy: Jonathan Bouchard; Temperature: -55°C to 125°C; Power: *; Supplier 1: Digikey; Supplier Part Number 1: 4399PHDKR-ND
J3 = CONN_TERMINAL_OSTTC040162: CONN -  TERMINAL BLOCK 4POS 5MM - TH; Mfg: On Shore Technology Inc.; Voltage: *; Current: *; Power: *; Mfg Part Number: OSTTC040162; HelpURL: http://www.on-shore.com/wp-content/uploads/2015/09/osttcxx0162.pdf; CreatedBy: Jonathan Bouchard; Temperature: -30°C ~ 105°C; Value: *; Precision: *; Package: TH-4; Supplier 1: Digikey; Supplier Part Number 1: ED2602-ND
U19 = POW_MOTOR_DRV8811PWPR: POW - STEPPER MOTOR DRIVER - SOP-28; Voltage: 3 V ~ 5.5 V / 8 V ~ 38 V; Mfg: Texas Instrument; Current: *; Power: *; Mfg Part Number: DRV8811PWPR; HelpURL: http://www.ti.com/lit/ds/symlink/drv8811.pdf; CreatedBy: Jonathan Bouchard; Temperature: -40°C ~ 150°C (TJ); Value: *; Precision: *; Package: SOP-28; Supplier 1: Digikey; Supplier Part Number 1: 296-24591-1-ND
R78 R79 R81-R84 = RES - 0603: Current: *; CreatedBy: Jonathan Bouchard
R80 R85 = RES - 1210: Current: *; CreatedBy: Jonathan Bouchard

## Sheet S7CAS-PLEIADES-CARTE-MERE_P06_MISC.SchDoc
size Tabloid; SheetNumber: 14; SheetTotal: 18; Sheet_Name: MISC; Size: 11x17
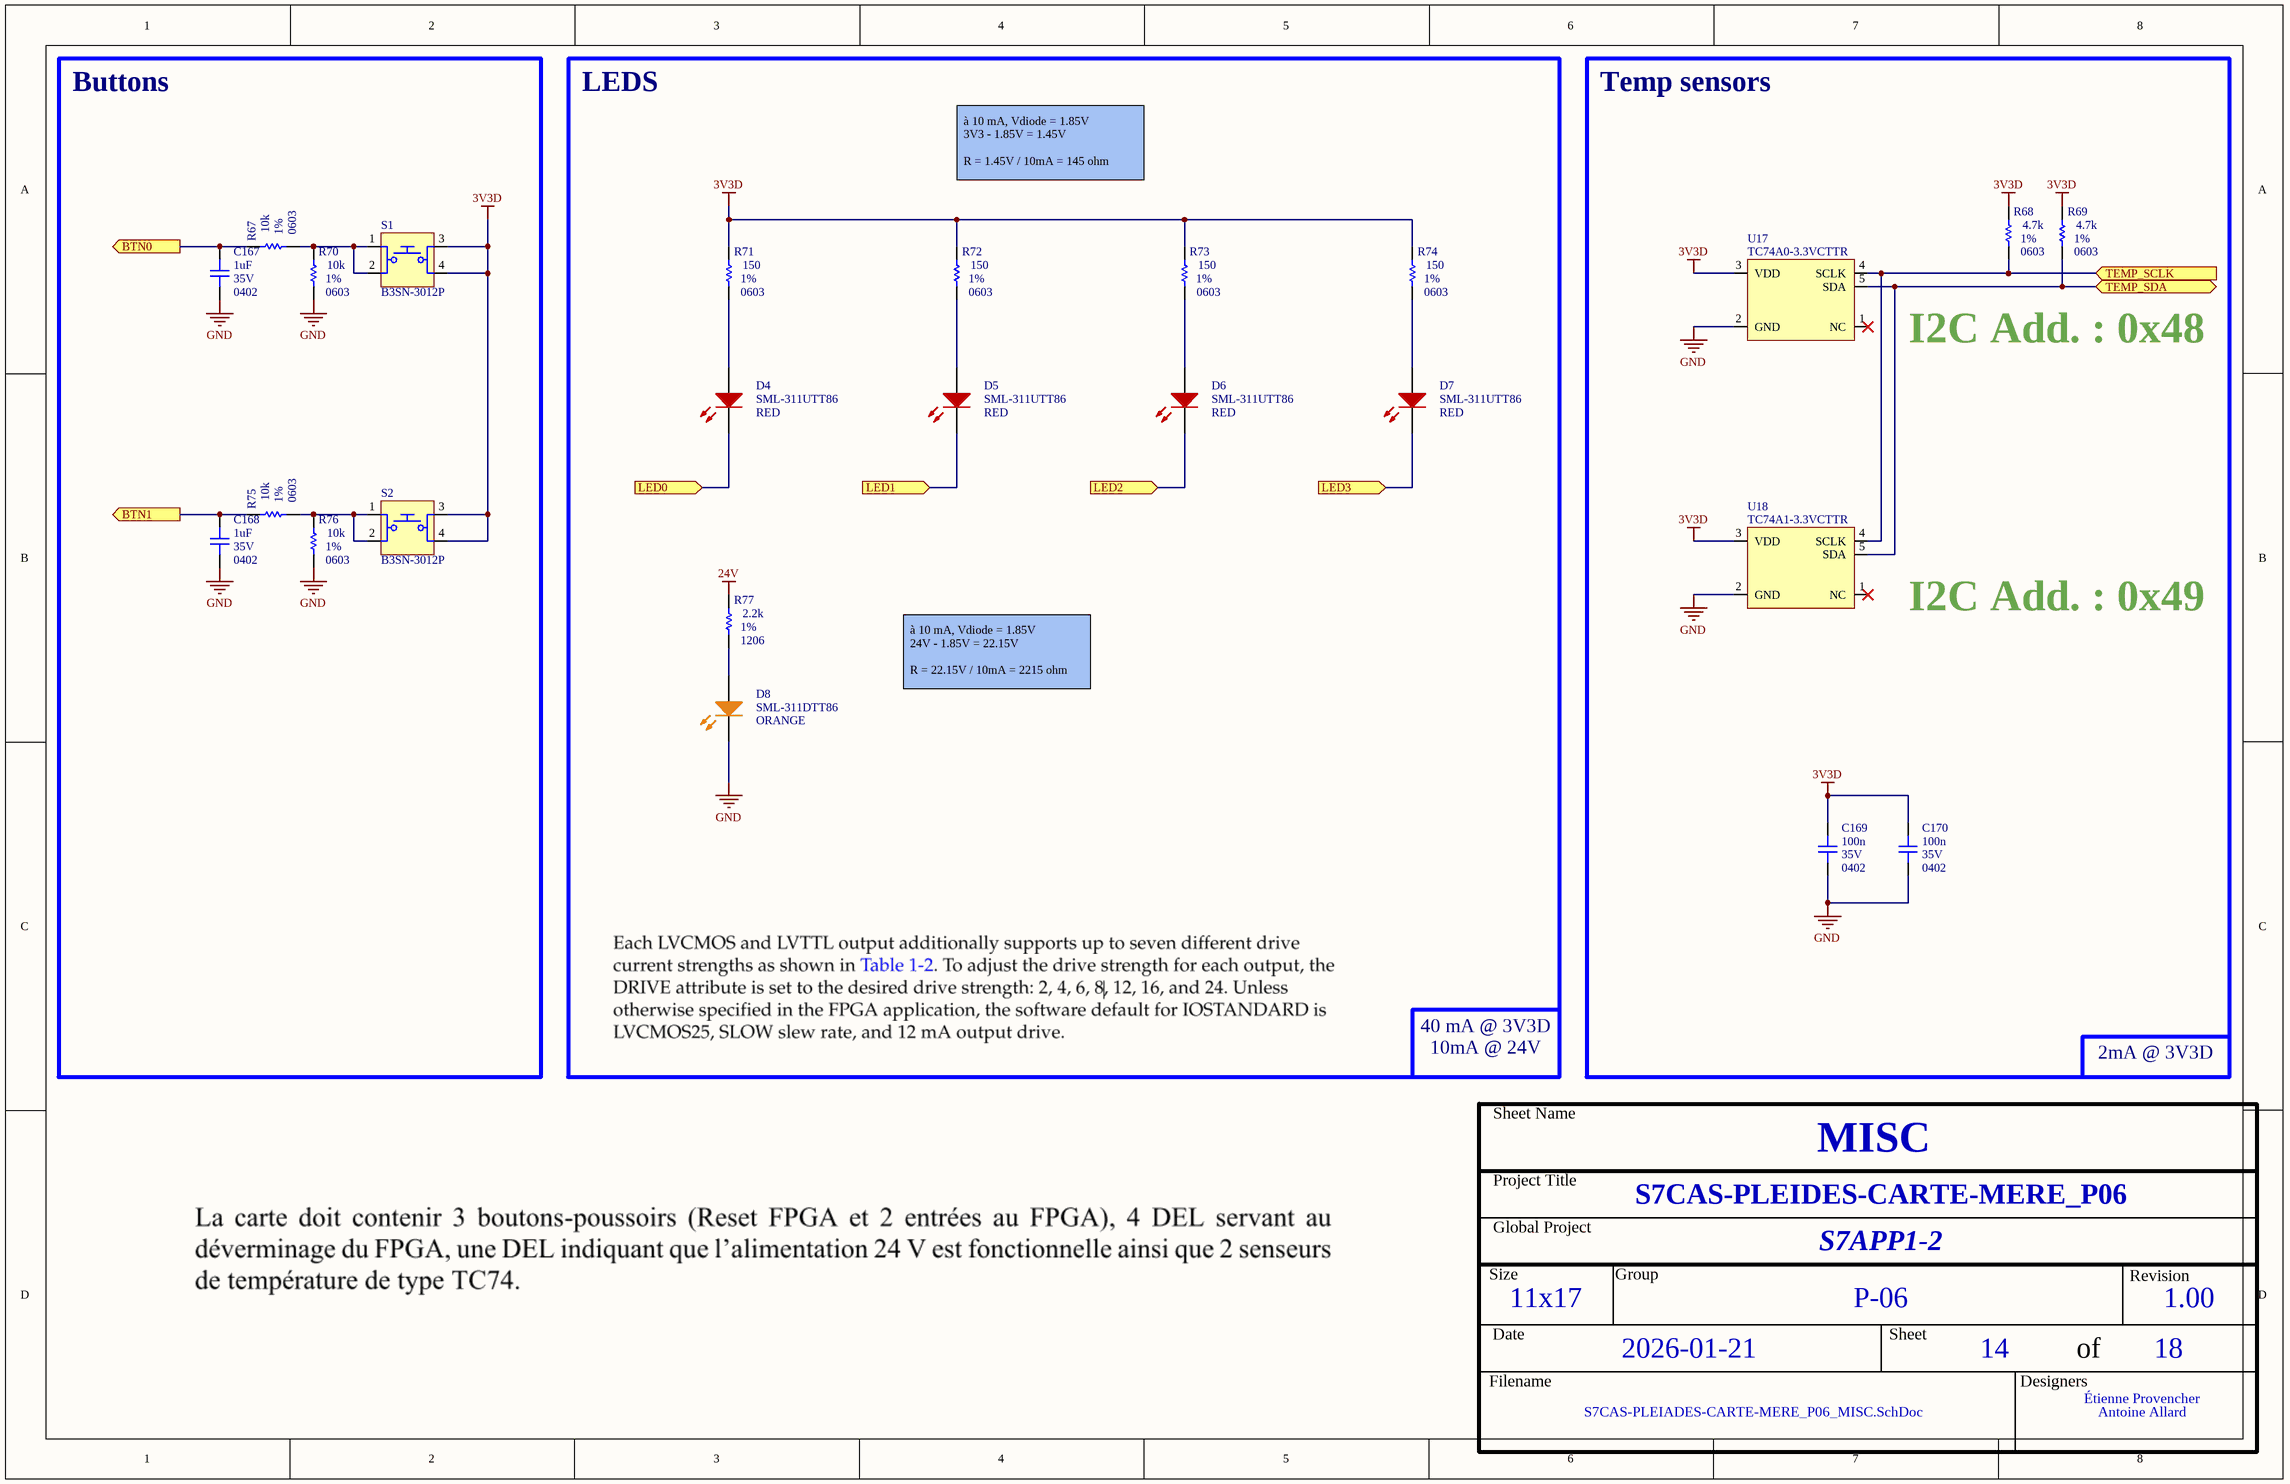
[diagram p43: S7CAS-PLEIADES-CARTE-MERE_P06_MISC.SchDoc]

### Parts
C167  value 1uF  Voltage: 35V  Package: 0402  [CAP_0402]  (hidden comment: CAP - 0402)
C168  value 1uF  Voltage: 35V  Package: 0402  [CAP_0402]  (hidden comment: CAP - 0402)
C169  value 100n  Voltage: 35V  Package: 0402  [CAP_0402]  (hidden comment: CAP - 0402)
C170  value 100n  Voltage: 35V  Package: 0402  [CAP_0402]  (hidden comment: CAP - 0402)
D4  SML-311UTT86  value RED  [LED_0603]
D5  SML-311UTT86  value RED  [LED_0603]
D6  SML-311UTT86  value RED  [LED_0603]
D7  SML-311UTT86  value RED  [LED_0603]
D8  SML-311DTT86  value ORANGE  [LED_0603]
R67  value 10k  Package: 0603  Precision: 1%  [RES_0603]  (hidden comment: RES - 0603)
R68  value 4.7k  Package: 0603  Precision: 1%  [RES_0603]  (hidden comment: RES - 0603)
R69  value 4.7k  Package: 0603  Precision: 1%  [RES_0603]  (hidden comment: RES - 0603)
R70  value 10k  Package: 0603  Precision: 1%  [RES_0603]  (hidden comment: RES - 0603)
R71  value 150  Package: 0603  Precision: 1%  [RES_0603]  (hidden comment: RES - 0603)
R72  value 150  Package: 0603  Precision: 1%  [RES_0603]  (hidden comment: RES - 0603)
R73  value 150  Package: 0603  Precision: 1%  [RES_0603]  (hidden comment: RES - 0603)
R74  value 150  Package: 0603  Precision: 1%  [RES_0603]  (hidden comment: RES - 0603)
R75  value 10k  Package: 0603  Precision: 1%  [RES_0603]  (hidden comment: RES - 0603)
R76  value 10k  Package: 0603  Precision: 1%  [RES_0603]  (hidden comment: RES - 0603)
R77  value 2.2k  Package: 1206  Precision: 1%  [RES_1206]  (hidden comment: RES - 1206)
S1  B3SN-3012P  [SWI_TACT_B3SN-3012P]
S2  B3SN-3012P  [SWI_TACT_B3SN-3012P]
U17  TC74A0-3.3VCTTR  [SEN_TEMP_TC74A0-3.3VCTTR]
U18  TC74A1-3.3VCTTR  [SEN_TEMP_TC74A0-3.3VCTTR]

### Blocks framed on the sheet
Buttons: C167 C168 R67 R70 R75 R76 S1 S2
LEDS: D4-D8 R71-R74 R77

### Ports
BTN0 (out, see S7CAS-PLEIADES-CARTE-MERE_P06_FPGA1[3B]), BTN1 (out, see S7CAS-PLEIADES-CARTE-MERE_P06_FPGA1[3B]), LED0 (in, see S7CAS-PLEIADES-CARTE-MERE_P06_FPGA1[3B]), LED1 (in, see S7CAS-PLEIADES-CARTE-MERE_P06_FPGA1[3B]), LED2 (in, see S7CAS-PLEIADES-CARTE-MERE_P06_FPGA1[3B]), LED3 (in, see S7CAS-PLEIADES-CARTE-MERE_P06_FPGA1[3B]), TEMP_SCLK (in, see S7CAS-PLEIADES-CARTE-MERE_P06_FPGA1[3B]), TEMP_SDA (bidir, see S7CAS-PLEIADES-CARTE-MERE_P06_FPGA1[3B])

### Nets
3V3D: C169.2 C170.2 R68.2 R69.2 R71.2 R72.2 R73.2 R74.2 S1.3 S1.4 S2.3 S2.4 U17.3(VDD) U18.3(VDD)
24V: R77.2
GND: C167.1 C168.1 C169.1 C170.1 D8.K R70.1 R76.1 U17.2(GND) U18.2(GND)
BTN0: C167.2 R67.2 ; port BTN0
BTN1: C168.2 R75.2 ; port BTN1
LED0: D4.K ; port LED0
LED1: D5.K ; port LED1
LED2: D6.K ; port LED2
LED3: D7.K ; port LED3
TEMP_SCLK: R68.1 U17.4(SCLK) U18.4(SCLK) ; port TEMP_SCLK
TEMP_SDA: R69.1 U17.5(SDA) U18.5(SDA) ; port TEMP_SDA
NetD4_A: D4.A R71.1
NetD5_A: D5.A R72.1
NetD6_A: D6.A R73.1
NetD7_A: D7.A R74.1
NetD8_A: D8.A R77.1
NetR67_1: R67.1 R70.2 S1.1 S1.2
NetR75_1: R75.1 R76.2 S2.1 S2.2

Not connected (* = marked no-connect by the designer): U17 1(NC)*; U18 1(NC)*

### Notes on the sheet
- Temp sensors
- à 10 mA, Vdiode = 1.85V
  3V3 - 1.85V = 1.45V
  R = 1.45V / 10mA = 145 ohm
- I2C Add. : 0x48
- I2C Add. : 0x49
- à 10 mA, Vdiode = 1.85V
  24V - 1.85V = 22.15V
  R = 22.15V / 10mA = 2215 ohm
- 40 mA @ 3V3D
  10mA @ 24V
- 2mA @ 3V3D
- Sheet Name
- Project Title
- Global Project
- Size
- Group
- Revision
- Date
- Sheet
- of
- Filename
- Designers

### Library data of the parts
C167-C170 = CAP - 0402: Precision: 10%; Current: *; CreatedBy: Jonathan Bouchard; Power: *
D4-D7 = LED_SML-311UTT86: LED - 620nM RED 2mA - 0603; Voltage: 1.8V; Mfg: ROHM Semiconductor; Power: 44mW; Current: 2mA; HelpURL: http://media.digikey.com/pdf/Data%20Sheets/Rohm%20PDFs/SML-311%20Series.pdf; CreatedBy: Jonathan Bouchard; Temperature: -30°C to 85°C; Package: 0603; Precision: *; Mfg Part Number: SML-311UTT86; Supplier 1: Digikey; Supplier Part Number 1: 511-1304-1-ND
D8 = LED_SML-311DTT86: LED - 611nM ORANGE 2mA - 0603; Voltage: 1.8V; Mfg: ROHM Semiconductor; Power: 44mW; Current: 2mA; HelpURL: http://media.digikey.com/pdf/Data%20Sheets/Rohm%20PDFs/SML-311%20Series.pdf; CreatedBy: Jonathan Bouchard; Temperature: -40°C to 85°C; Package: 0603; Precision: *; Mfg Part Number: SML-311DTT86; Supplier 1: Digikey; Supplier Part Number 1: 511-1303-1-ND
R77 = RES - 1206: Power: 0.4W; Current: *; CreatedBy: Jonathan Bouchard
S1 S2 = SWI_TACT_B3SN-3012P_1: SWI - SWITCH TACTILE SPST-NO 0.05A 24V -SMD; Manufacturer #1: Omron Electronics Inc-EMC Div; Current Rating: 50mA; Voltage rating: 24VDC; Polarized: No; Magnetic Material: UNKNOWN; GRAMS Lib Spec: 2.8; Manufacturer #2: *; Power Max: *; Value: SPST-NO; Part Number #1: B3SN-3012P; Part Number #2: *; HelpURL: http://omronfs.omron.com/en_US/ecb/products/pdf/en-b3sn.pdf; Supplier 1: Digi-Key; Supplier Part Number 1: SW261CT-ND; Assembly Type: SMD; Temperature: -25°C ~ 70°C; Package: SMD; CreatedBy/Date: Olivier Bernard / 5/12/2017; Tolerance: *; VerifiedBy: Caroline Paulin / 11 juillet 2018; Cryo: UNKNOWN
U17 U18 = SENS_TEMP_TC74A0-3.3VCTTR: SENS - TEMPERATURE SENSOR I2C/SMBUS - SOT23-5; Voltage: 2.7 V ~ 5.5 V; Mfg: Microchip; Precision: ±2°C (±3°C); Current: *; Power: *; Mfg Part Number: TC74A0-3.3VCTTR; HelpURL: http://ww1.microchip.com/downloads/en/DeviceDoc/21462D.pdf; CreatedBy: Jonathan Bouchard; Temperature: -40°C ~ 125°C; Value: *; Package: SOT23-5; Supplier 1: Digikey; Supplier Part Number 1: TC74A0-3.3VCTDKR-ND
R67-R76 = RES - 0603: Current: *; CreatedBy: Jonathan Bouchard

## Sheet S7CAS-PLEIADES-CARTE-MERE_P06_FLASH.SCHDOC
size Tabloid; SheetNumber: 15; SheetTotal: 18; Sheet_Name: FLASH; Size: 11x17
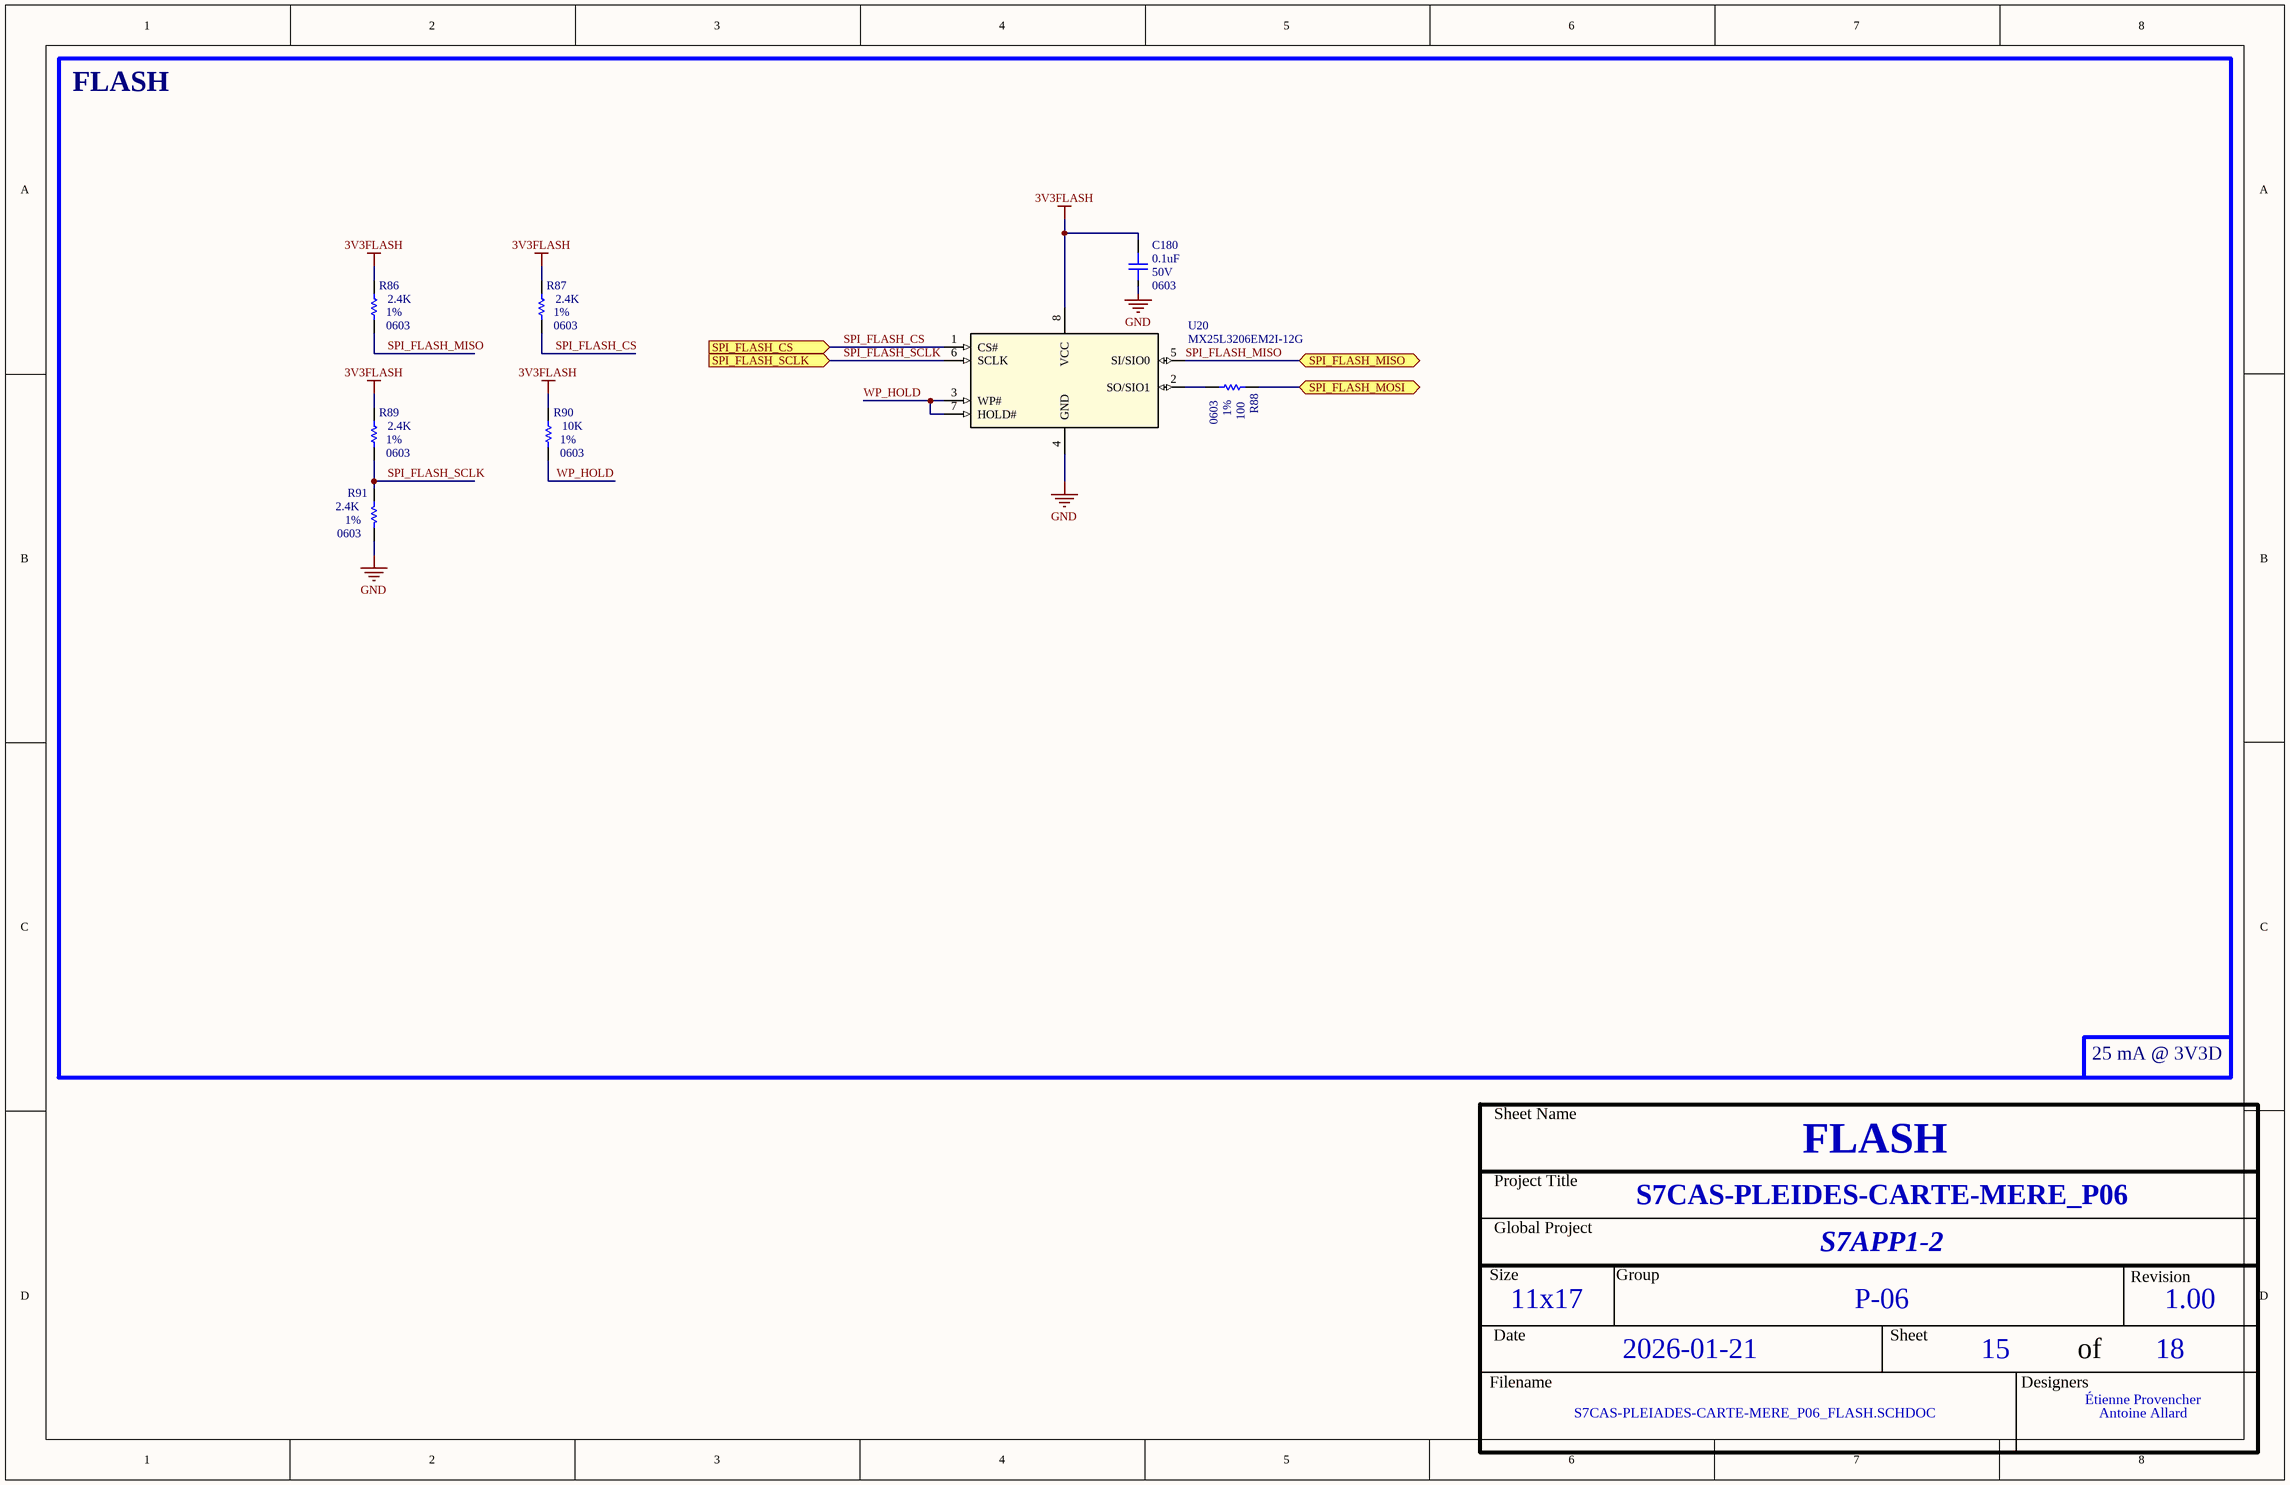
[diagram p44: S7CAS-PLEIADES-CARTE-MERE_P06_FLASH.SCHDOC]

### Parts
C180  value 0.1uF  Voltage: 50V  Package: 0603  [CAP_0603]  (hidden comment: CAP - 0603)
R86  value 2.4K  Package: 0603  Precision: 1%  [RES_0603]  (hidden comment: RES - 0603)
R87  value 2.4K  Package: 0603  Precision: 1%  [RES_0603]  (hidden comment: RES - 0603)
R88  value 100  Package: 0603  Precision: 1%  [RES_0603]  (hidden comment: RES - 0603)
R89  value 2.4K  Package: 0603  Precision: 1%  [RES_0603]  (hidden comment: RES - 0603)
R90  value 10K  Package: 0603  Precision: 1%  [RES_0603]  (hidden comment: RES - 0603)
R91  value 2.4K  Package: 0603  Precision: 1%  [RES_0603]  (hidden comment: RES - 0603)
U20  MX25L3206EM2I-12G  [SOP8L_200MIL_6110-1406_MAC]

### Blocks framed on the sheet
FLASH: C180 R86-R91 U20

### Ports
SPI_FLASH_CS (in, see S7CAS-PLEIADES-CARTE-MERE_P06_FPGA2[3C]), SPI_FLASH_MISO (bidir, see S7CAS-PLEIADES-CARTE-MERE_P06_FPGA2[1A]), SPI_FLASH_MOSI (bidir, see S7CAS-PLEIADES-CARTE-MERE_P06_FPGA2[1A]), SPI_FLASH_SCLK (in, see S7CAS-PLEIADES-CARTE-MERE_P06_FPGA2[1A])

### Nets
3V3FLASH: C180.2 R86.2 R87.2 R89.2 R90.2 U20.8(VCC)
GND: C180.1 R91.1 U20.4(GND)
SPI_FLASH_CS: R87.1 U20.1(CS#) ; port SPI_FLASH_CS
SPI_FLASH_MISO: R86.1 U20.5(SI/SIO0) ; port SPI_FLASH_MISO
SPI_FLASH_MOSI: R88.2 ; port SPI_FLASH_MOSI
SPI_FLASH_SCLK: R89.1 R91.2 U20.6(SCLK) ; port SPI_FLASH_SCLK
WP_HOLD: R90.1 U20.3(WP#) U20.7(HOLD#)
NetR88_1: R88.1 U20.2(SO/SIO1)

### Notes on the sheet
- 25 mA @ 3V3D
- Sheet Name
- Project Title
- Global Project
- Size
- Group
- Revision
- Date
- Sheet
- of
- Filename
- Designers

### Library data of the parts
C180 = CAP - 0603: Precision: 10%; Current: *; CreatedBy: Jonathan Bouchard; Power: *
U20 = MX25L3206EM2I-12G: Description; Manufacturer_Name: Macronix; Copyright: Copyright (C) 2025 Ultra Librarian. All rights reserved.; Manufacturer_Part_Number: MX25L3206EM2I-12G; RefDes: RefDes; Type: Type
R86-R91 = RES - 0603: Current: *; CreatedBy: Jonathan Bouchard

## Sheet S7CAS-PLEIADES-CARTE-MERE_P06_ADC.SchDoc
size Tabloid; SheetNumber: 16; SheetTotal: 18; Sheet_Name: ADC; Size: 11x17
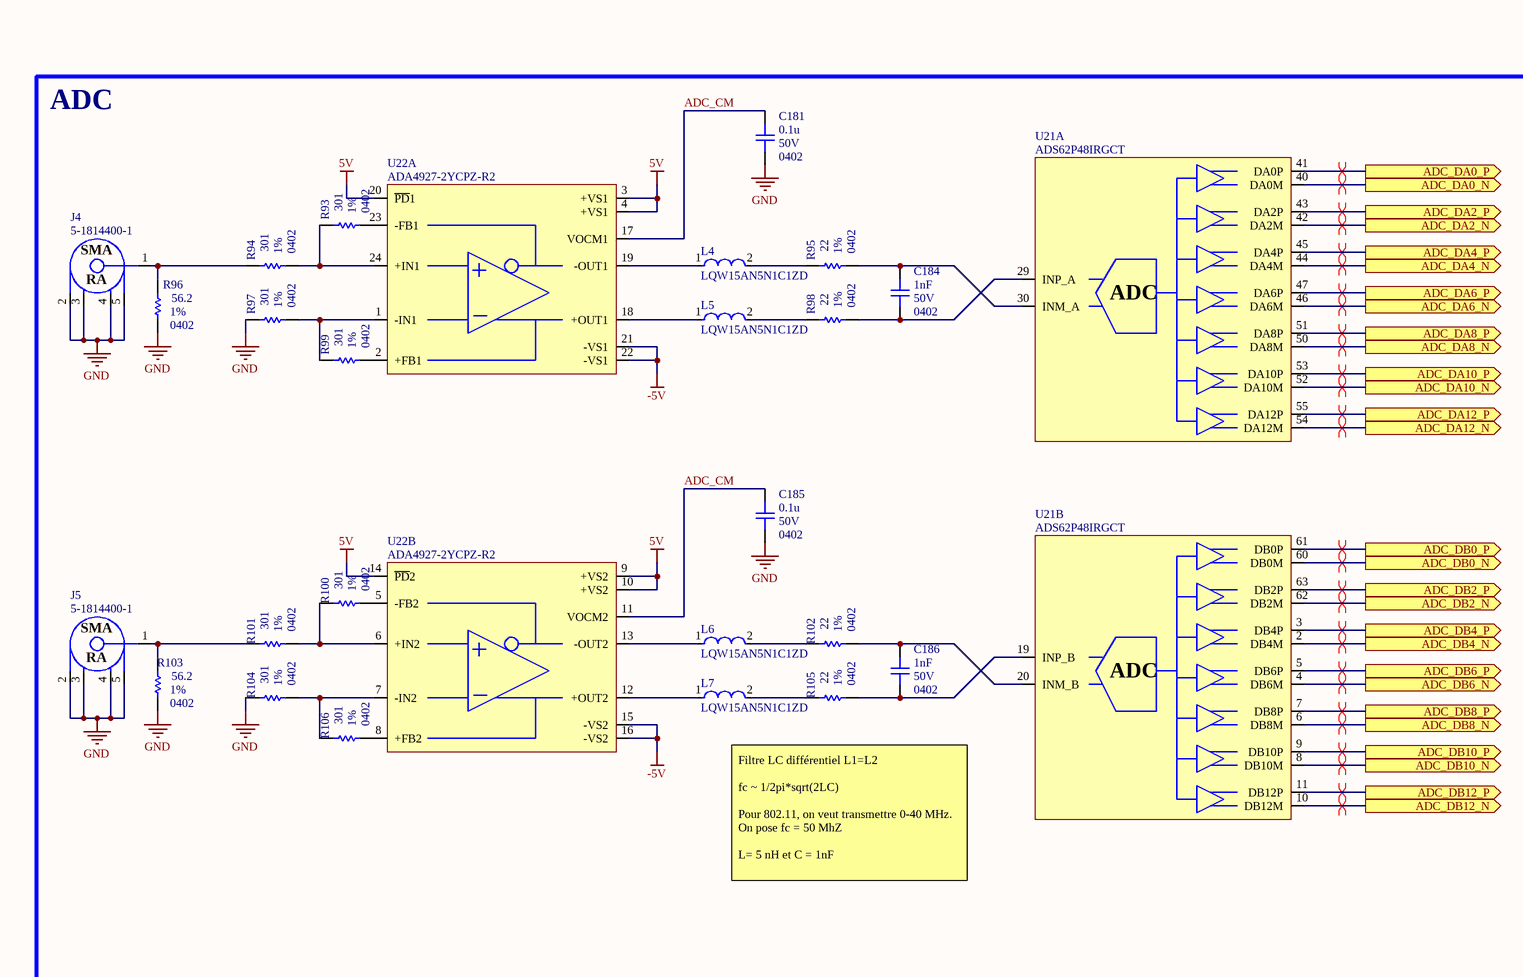
[diagram p45: S7CAS-PLEIADES-CARTE-MERE_P06_ADC.SchDoc, top left]
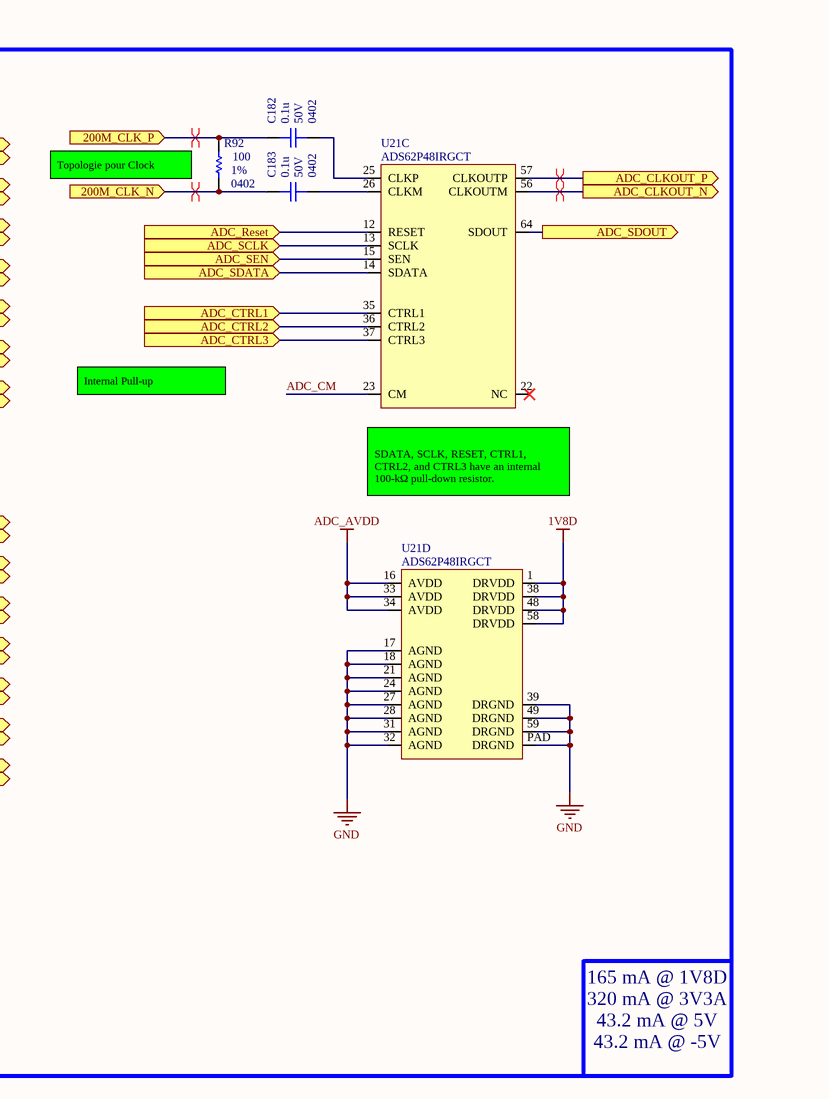
[diagram p46: S7CAS-PLEIADES-CARTE-MERE_P06_ADC.SchDoc, top middle]
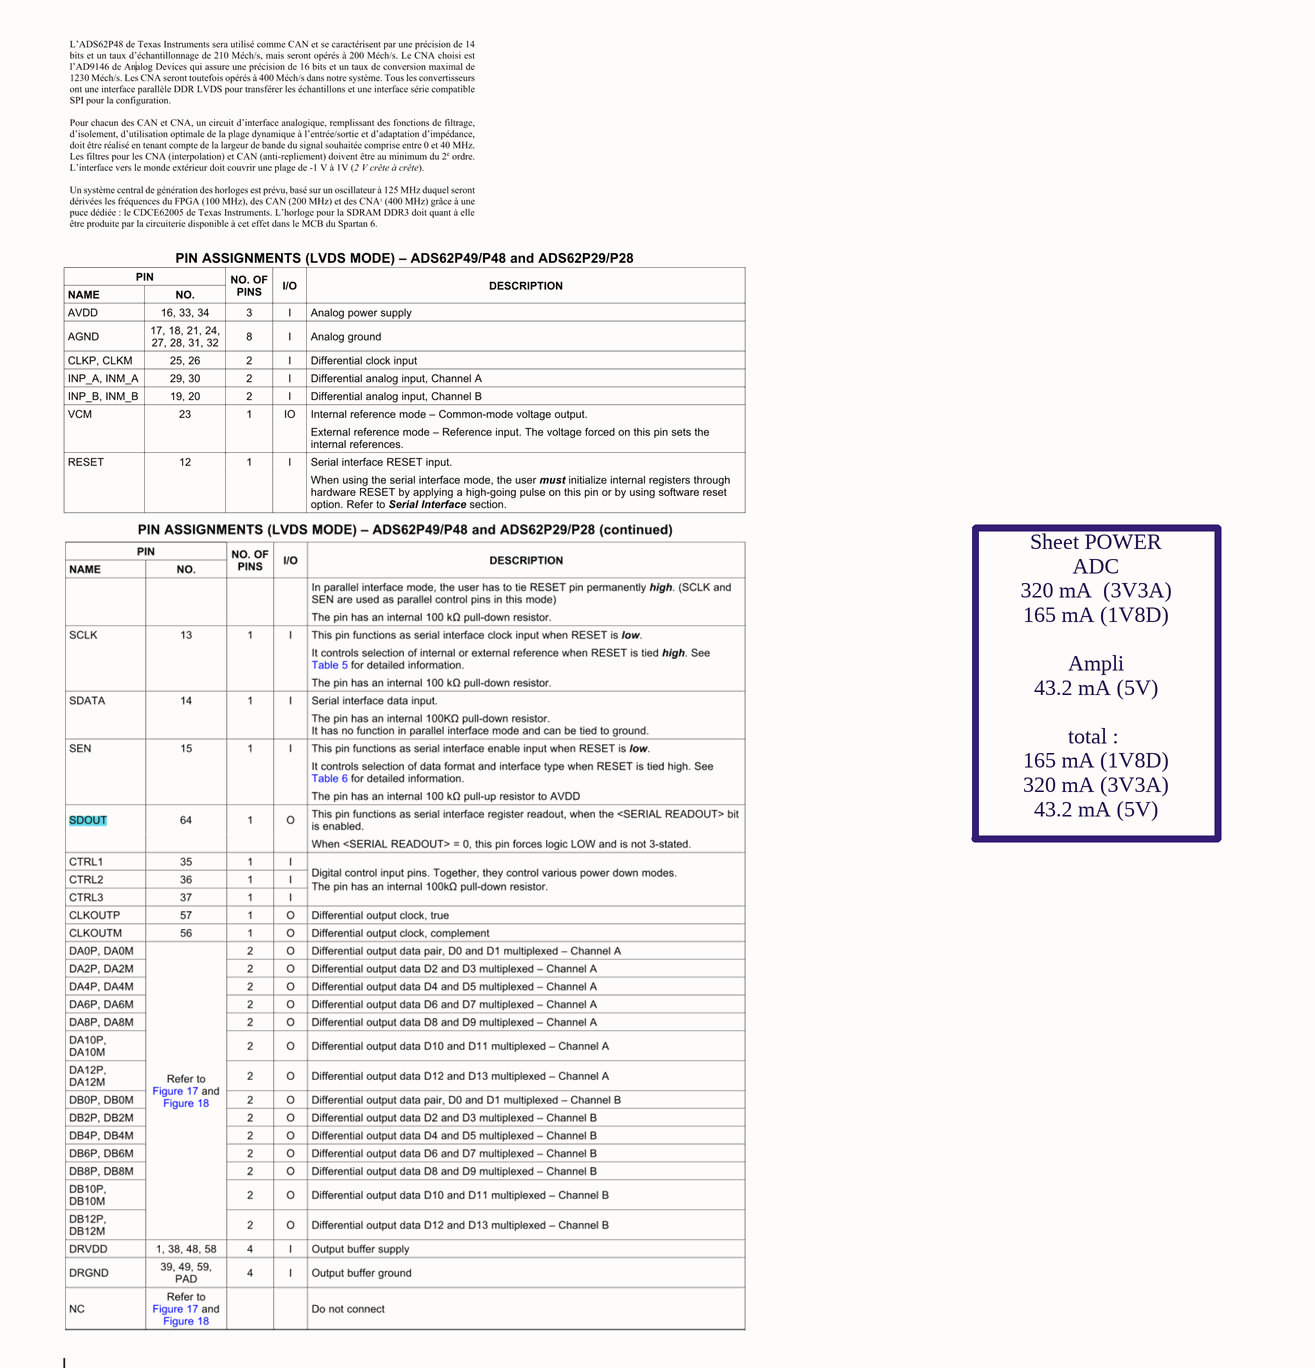
[diagram p47: S7CAS-PLEIADES-CARTE-MERE_P06_ADC.SchDoc, top right]
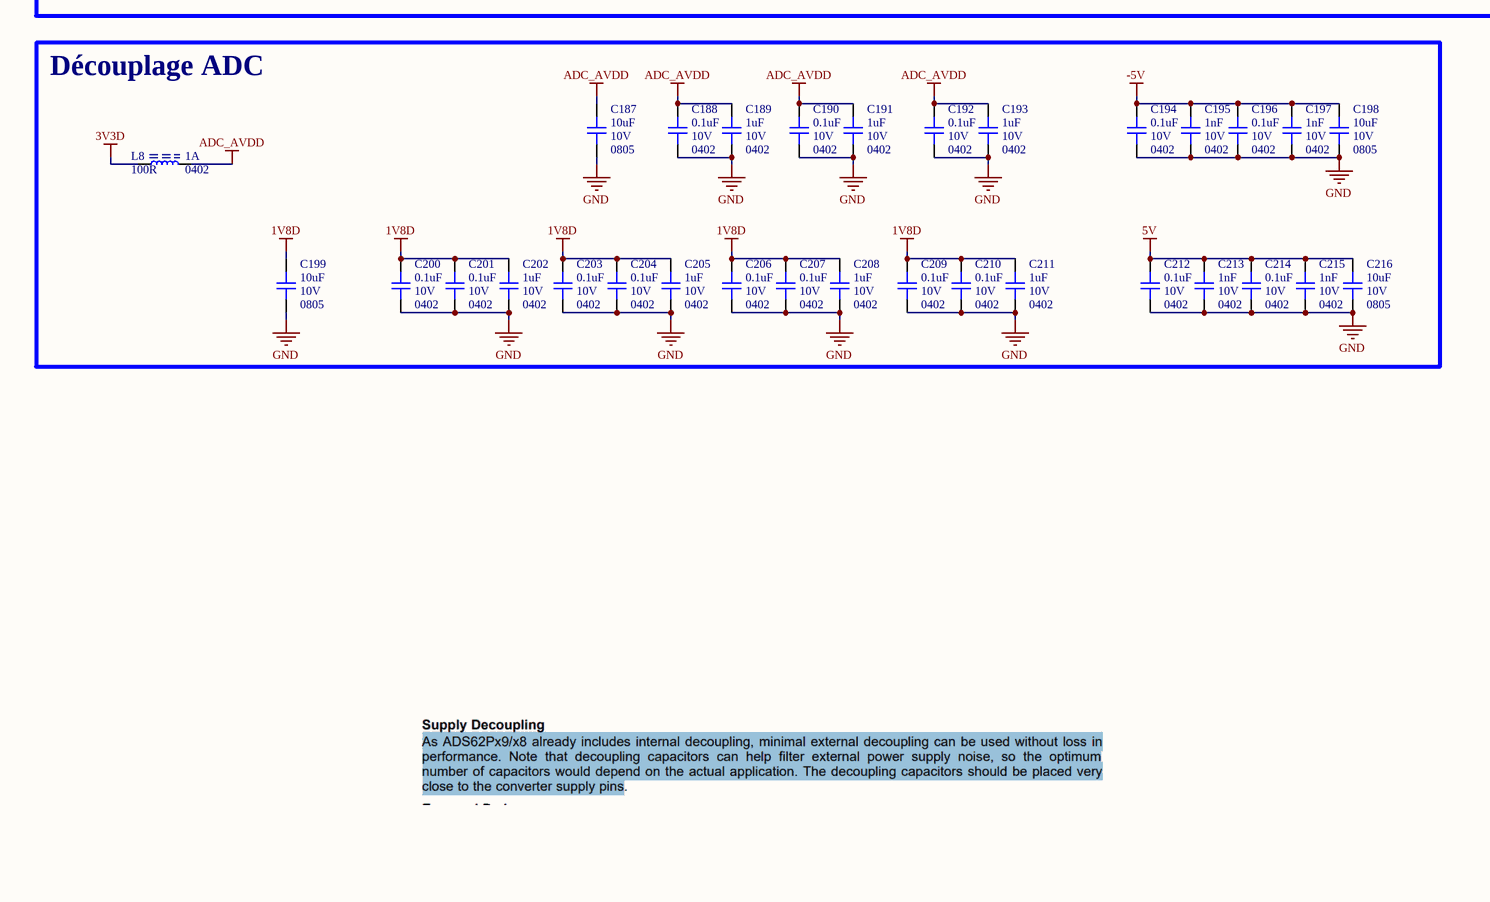
[diagram p48: S7CAS-PLEIADES-CARTE-MERE_P06_ADC.SchDoc, bottom left]
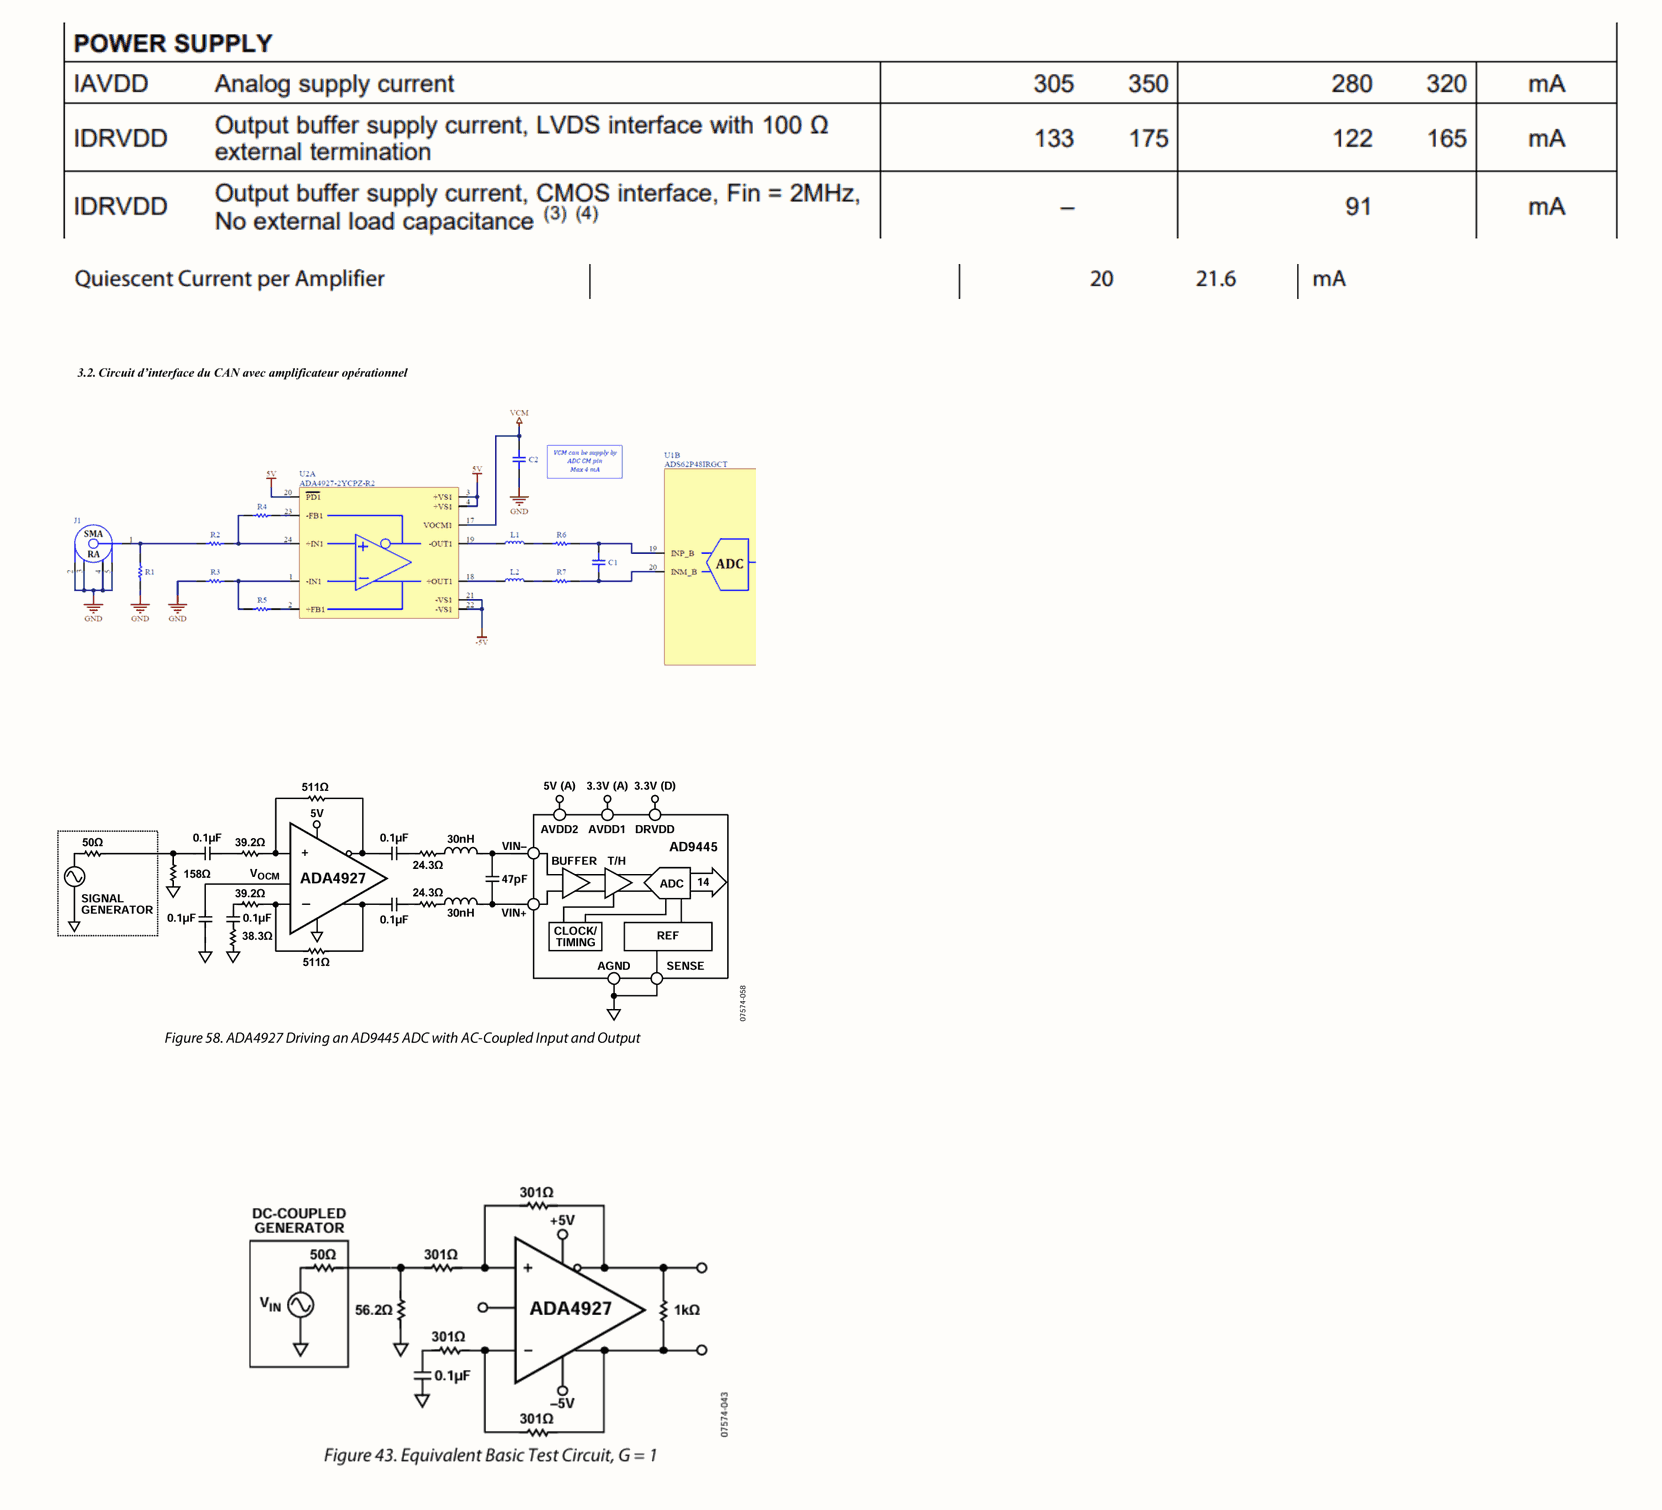
[diagram p49: S7CAS-PLEIADES-CARTE-MERE_P06_ADC.SchDoc, bottom right]

### Parts
C181  value 0.1u  Voltage: 50V  Package: 0402  [CAP_0402]  (hidden comment: CAP - 0402)
C182  value 0.1u  Voltage: 50V  Package: 0402  [CAP_0402]  (hidden comment: CAP - 0402)
C183  value 0.1u  Voltage: 50V  Package: 0402  [CAP_0402]  (hidden comment: CAP - 0402)
C184  value 1nF  Voltage: 50V  Package: 0402  [CAP_0402]  (hidden comment: CAP - 0402)
C185  value 0.1u  Voltage: 50V  Package: 0402  [CAP_0402]  (hidden comment: CAP - 0402)
C186  value 1nF  Voltage: 50V  Package: 0402  [CAP_0402]  (hidden comment: CAP - 0402)
C187  value 10uF  Voltage: 10V  Package: 0805  [CAP_0805]  (hidden comment: CAP - 0805)
C188  value 0.1uF  Voltage: 10V  Package: 0402  [CAP_0402]  (hidden comment: CAP - 0402)
C189  value 1uF  Voltage: 10V  Package: 0402  [CAP_0402]  (hidden comment: CAP - 0402)
C190  value 0.1uF  Voltage: 10V  Package: 0402  [CAP_0402]  (hidden comment: CAP - 0402)
C191  value 1uF  Voltage: 10V  Package: 0402  [CAP_0402]  (hidden comment: CAP - 0402)
C192  value 0.1uF  Voltage: 10V  Package: 0402  [CAP_0402]  (hidden comment: CAP - 0402)
C193  value 1uF  Voltage: 10V  Package: 0402  [CAP_0402]  (hidden comment: CAP - 0402)
C194  value 0.1uF  Voltage: 10V  Package: 0402  [CAP_0402]  (hidden comment: CAP - 0402)
C195  value 1nF  Voltage: 10V  Package: 0402  [CAP_0402]  (hidden comment: CAP - 0402)
C196  value 0.1uF  Voltage: 10V  Package: 0402  [CAP_0402]  (hidden comment: CAP - 0402)
C197  value 1nF  Voltage: 10V  Package: 0402  [CAP_0402]  (hidden comment: CAP - 0402)
C198  value 10uF  Voltage: 10V  Package: 0805  [CAP_0805]  (hidden comment: CAP - 0805)
C199  value 10uF  Voltage: 10V  Package: 0805  [CAP_0805]  (hidden comment: CAP - 0805)
C200  value 0.1uF  Voltage: 10V  Package: 0402  [CAP_0402]  (hidden comment: CAP - 0402)
C201  value 0.1uF  Voltage: 10V  Package: 0402  [CAP_0402]  (hidden comment: CAP - 0402)
C202  value 1uF  Voltage: 10V  Package: 0402  [CAP_0402]  (hidden comment: CAP - 0402)
C203  value 0.1uF  Voltage: 10V  Package: 0402  [CAP_0402]  (hidden comment: CAP - 0402)
C204  value 0.1uF  Voltage: 10V  Package: 0402  [CAP_0402]  (hidden comment: CAP - 0402)
C205  value 1uF  Voltage: 10V  Package: 0402  [CAP_0402]  (hidden comment: CAP - 0402)
C206  value 0.1uF  Voltage: 10V  Package: 0402  [CAP_0402]  (hidden comment: CAP - 0402)
C207  value 0.1uF  Voltage: 10V  Package: 0402  [CAP_0402]  (hidden comment: CAP - 0402)
C208  value 1uF  Voltage: 10V  Package: 0402  [CAP_0402]  (hidden comment: CAP - 0402)
C209  value 0.1uF  Voltage: 10V  Package: 0402  [CAP_0402]  (hidden comment: CAP - 0402)
C210  value 0.1uF  Voltage: 10V  Package: 0402  [CAP_0402]  (hidden comment: CAP - 0402)
C211  value 1uF  Voltage: 10V  Package: 0402  [CAP_0402]  (hidden comment: CAP - 0402)
C212  value 0.1uF  Voltage: 10V  Package: 0402  [CAP_0402]  (hidden comment: CAP - 0402)
C213  value 1nF  Voltage: 10V  Package: 0402  [CAP_0402]  (hidden comment: CAP - 0402)
C214  value 0.1uF  Voltage: 10V  Package: 0402  [CAP_0402]  (hidden comment: CAP - 0402)
C215  value 1nF  Voltage: 10V  Package: 0402  [CAP_0402]  (hidden comment: CAP - 0402)
C216  value 10uF  Voltage: 10V  Package: 0805  [CAP_0805]  (hidden comment: CAP - 0805)
J4  5-1814400-1  [CONN_SMA_5-1814400-1]
J5  5-1814400-1  [CONN_SMA_5-1814400-1]
L4  LQW15AN5N1C1ZD  [FP-LQW15AN_00-W0_6-0_1-MFG]
L5  LQW15AN5N1C1ZD  [FP-LQW15AN_00-W0_6-0_1-MFG]
L6  LQW15AN5N1C1ZD  [FP-LQW15AN_00-W0_6-0_1-MFG]
L7  LQW15AN5N1C1ZD  [FP-LQW15AN_00-W0_6-0_1-MFG]
L8  value 100R  Current: 1A  Package: 0402  [FER_0402]  (hidden comment: FER - 0402)
R92  value 100  Package: 0402  Precision: 1%  [RES_0402]  (hidden comment: RES - 0402)
R93  value 301  Package: 0402  Precision: 1%  [RES_0402]  (hidden comment: RES - 0402)
R94  value 301  Package: 0402  Precision: 1%  [RES_0402]  (hidden comment: RES - 0402)
R95  value 22  Package: 0402  Precision: 1%  [RES_0402]  (hidden comment: RES - 0402)
R96  value 56.2  Package: 0402  Precision: 1%  [RES_0402]  (hidden comment: RES - 0402)
R97  value 301  Package: 0402  Precision: 1%  [RES_0402]  (hidden comment: RES - 0402)
R98  value 22  Package: 0402  Precision: 1%  [RES_0402]  (hidden comment: RES - 0402)
R99  value 301  Package: 0402  Precision: 1%  [RES_0402]  (hidden comment: RES - 0402)
R100  value 301  Package: 0402  Precision: 1%  [RES_0402]  (hidden comment: RES - 0402)
R101  value 301  Package: 0402  Precision: 1%  [RES_0402]  (hidden comment: RES - 0402)
R102  value 22  Package: 0402  Precision: 1%  [RES_0402]  (hidden comment: RES - 0402)
R103  value 56.2  Package: 0402  Precision: 1%  [RES_0402]  (hidden comment: RES - 0402)
R104  value 301  Package: 0402  Precision: 1%  [RES_0402]  (hidden comment: RES - 0402)
R105  value 22  Package: 0402  Precision: 1%  [RES_0402]  (hidden comment: RES - 0402)
R106  value 301  Package: 0402  Precision: 1%  [RES_0402]  (hidden comment: RES - 0402)
U21  ADS62P48IRGCT  [ADC_ADS62P48IRGCT]  (parts A,B,C,D of 4)
U22  ADA4927-2YCPZ-R2  [OPAMP_ADA4927-2YCPZ-R2]  (parts A,B of 2)

### Blocks framed on the sheet
ADC: C181-C186 J4 J5 L4-L7 R92-R106 U21 U22
Découplage ADC: C187-C216 L8

### Ports
200M_CLK_N (in, see S7CAS-PLEIADES-CARTE-MERE_P06_CLOCK[4A]), 200M_CLK_P (in, see S7CAS-PLEIADES-CARTE-MERE_P06_CLOCK[4A]), ADC_CLKOUT_N (out, see S7CAS-PLEIADES-CARTE-MERE_P06_FPGA1[4B]), ADC_CLKOUT_P (out, see S7CAS-PLEIADES-CARTE-MERE_P06_FPGA1[4B]), ADC_CTRL1 (in, see S7CAS-PLEIADES-CARTE-MERE_P06_FPGA3[4B]), ADC_CTRL2 (in, see S7CAS-PLEIADES-CARTE-MERE_P06_FPGA3[4B]), ADC_CTRL3 (in, see S7CAS-PLEIADES-CARTE-MERE_P06_FPGA3[4B]), ADC_DA0_N (out, see S7CAS-PLEIADES-CARTE-MERE_P06_FPGA1[6A]), ADC_DA0_P (out, see S7CAS-PLEIADES-CARTE-MERE_P06_FPGA1[6A]), ADC_DA2_N (out, see S7CAS-PLEIADES-CARTE-MERE_P06_FPGA1[6A]), ADC_DA2_P (out, see S7CAS-PLEIADES-CARTE-MERE_P06_FPGA1[6A]), ADC_DA4_N (out, see S7CAS-PLEIADES-CARTE-MERE_P06_FPGA1[6A]), ADC_DA4_P (out, see S7CAS-PLEIADES-CARTE-MERE_P06_FPGA1[6A]), ADC_DA6_N (out, see S7CAS-PLEIADES-CARTE-MERE_P06_FPGA1[6A]), ADC_DA6_P (out, see S7CAS-PLEIADES-CARTE-MERE_P06_FPGA1[6A]), ADC_DA8_N (out, see S7CAS-PLEIADES-CARTE-MERE_P06_FPGA1[6B]), ADC_DA8_P (out, see S7CAS-PLEIADES-CARTE-MERE_P06_FPGA1[6B]), ADC_DA10_N (out, see S7CAS-PLEIADES-CARTE-MERE_P06_FPGA1[6B]), ADC_DA10_P (out, see S7CAS-PLEIADES-CARTE-MERE_P06_FPGA1[6B]), ADC_DA12_N (out, see S7CAS-PLEIADES-CARTE-MERE_P06_FPGA1[6B]), ADC_DA12_P (out, see S7CAS-PLEIADES-CARTE-MERE_P06_FPGA1[6B]), ADC_DB0_N (out, see S7CAS-PLEIADES-CARTE-MERE_P06_FPGA1[6B]), ADC_DB0_P (out, see S7CAS-PLEIADES-CARTE-MERE_P06_FPGA1[6B]), ADC_DB2_N (out, see S7CAS-PLEIADES-CARTE-MERE_P06_FPGA1[6B]), ADC_DB2_P (out, see S7CAS-PLEIADES-CARTE-MERE_P06_FPGA1[6B]), ADC_DB4_N (out, see S7CAS-PLEIADES-CARTE-MERE_P06_FPGA1[6B]), ADC_DB4_P (out, see S7CAS-PLEIADES-CARTE-MERE_P06_FPGA1[6B]), ADC_DB6_N (out, see S7CAS-PLEIADES-CARTE-MERE_P06_FPGA1[6B]), ADC_DB6_P (out, see S7CAS-PLEIADES-CARTE-MERE_P06_FPGA1[6B]), ADC_DB8_N (out, see S7CAS-PLEIADES-CARTE-MERE_P06_FPGA1[6B]), ADC_DB8_P (out, see S7CAS-PLEIADES-CARTE-MERE_P06_FPGA1[6B]), ADC_DB10_N (out, see S7CAS-PLEIADES-CARTE-MERE_P06_FPGA1[6B]), ADC_DB10_P (out, see S7CAS-PLEIADES-CARTE-MERE_P06_FPGA1[6B]), ADC_DB12_N (out, see S7CAS-PLEIADES-CARTE-MERE_P06_FPGA1[6B]), ADC_DB12_P (out, see S7CAS-PLEIADES-CARTE-MERE_P06_FPGA1[6B]), ADC_Reset (in, see S7CAS-PLEIADES-CARTE-MERE_P06_FPGA3[4A]), ADC_SCLK (in, see S7CAS-PLEIADES-CARTE-MERE_P06_FPGA3[4B]), ADC_SDATA (in, see S7CAS-PLEIADES-CARTE-MERE_P06_FPGA3[4B]), ADC_SDOUT (out, see S7CAS-PLEIADES-CARTE-MERE_P06_FPGA3[4B]), ADC_SEN (in, see S7CAS-PLEIADES-CARTE-MERE_P06_FPGA3[4B])

### Nets
1V8D: C199.2 C200.2 C201.2 C202.2 C203.2 C204.2 C205.2 C206.2 C207.2 C208.2 C209.2 C210.2 C211.2 U21.1(DRVDD) U21.38(DRVDD) U21.48(DRVDD) U21.58(DRVDD)
3V3D: L8.2
5V: C212.2 C213.2 C214.2 C215.2 C216.2 U22.3(+VS1) U22.4(+VS1) U22.9(+VS2) U22.10(+VS2) U22.14(~{PD}2) U22.20(~{PD}1)
-5V: C194.2 C195.2 C196.2 C197.2 C198.2 U22.15(-VS2) U22.16(-VS2) U22.21(-VS1) U22.22(-VS1)
ADC_AVDD: C187.2 C188.2 C189.2 C190.2 C191.2 C192.2 C193.2 L8.1 U21.16(AVDD) U21.33(AVDD) U21.34(AVDD)
GND: C181.1 C185.1 C187.1 C188.1 C189.1 C190.1 C191.1 C192.1 C193.1 C194.1 C195.1 C196.1 C197.1 C198.1 C199.1 C200.1 C201.1 C202.1 C203.1 C204.1 C205.1 C206.1 C207.1 C208.1 C209.1 C210.1 C211.1 C212.1 C213.1 C214.1 C215.1 C216.1 J4.2 J4.3 J4.4 J4.5 J5.2 J5.3 J5.4 J5.5 R96.1 R97.2 R103.1 R104.2 U21.17(AGND) U21.18(AGND) U21.21(AGND) U21.24(AGND) U21.27(AGND) U21.28(AGND) U21.31(AGND) U21.32(AGND) U21.39(DRGND) U21.49(DRGND) U21.59(DRGND) U21.PAD(DRGND)
200M_CLK_N: C183.2 R92.1 ; port 200M_CLK_N
200M_CLK_P: C182.2 R92.2 ; port 200M_CLK_P
ADC_CLKOUT_N: U21.56(CLKOUTM) ; port ADC_CLKOUT_N
ADC_CLKOUT_P: U21.57(CLKOUTP) ; port ADC_CLKOUT_P
ADC_CM: C181.2 C185.2 U21.23(CM) U22.11(VOCM2) U22.17(VOCM1)
ADC_CTRL1: U21.35(CTRL1) ; port ADC_CTRL1
ADC_CTRL2: U21.36(CTRL2) ; port ADC_CTRL2
ADC_CTRL3: U21.37(CTRL3) ; port ADC_CTRL3
ADC_DA0_N: U21.40(DA0M) ; port ADC_DA0_N
ADC_DA0_P: U21.41(DA0P) ; port ADC_DA0_P
ADC_DA2_N: U21.42(DA2M) ; port ADC_DA2_N
ADC_DA2_P: U21.43(DA2P) ; port ADC_DA2_P
ADC_DA4_N: U21.44(DA4M) ; port ADC_DA4_N
ADC_DA4_P: U21.45(DA4P) ; port ADC_DA4_P
ADC_DA6_N: U21.46(DA6M) ; port ADC_DA6_N
ADC_DA6_P: U21.47(DA6P) ; port ADC_DA6_P
ADC_DA8_N: U21.50(DA8M) ; port ADC_DA8_N
ADC_DA8_P: U21.51(DA8P) ; port ADC_DA8_P
ADC_DA10_N: U21.52(DA10M) ; port ADC_DA10_N
ADC_DA10_P: U21.53(DA10P) ; port ADC_DA10_P
ADC_DA12_N: U21.54(DA12M) ; port ADC_DA12_N
ADC_DA12_P: U21.55(DA12P) ; port ADC_DA12_P
ADC_DB0_N: U21.60(DB0M) ; port ADC_DB0_N
ADC_DB0_P: U21.61(DB0P) ; port ADC_DB0_P
ADC_DB2_N: U21.62(DB2M) ; port ADC_DB2_N
ADC_DB2_P: U21.63(DB2P) ; port ADC_DB2_P
ADC_DB4_N: U21.2(DB4M) ; port ADC_DB4_N
ADC_DB4_P: U21.3(DB4P) ; port ADC_DB4_P
ADC_DB6_N: U21.4(DB6M) ; port ADC_DB6_N
ADC_DB6_P: U21.5(DB6P) ; port ADC_DB6_P
ADC_DB8_N: U21.6(DB8M) ; port ADC_DB8_N
ADC_DB8_P: U21.7(DB8P) ; port ADC_DB8_P
ADC_DB10_N: U21.8(DB10M) ; port ADC_DB10_N
ADC_DB10_P: U21.9(DB10P) ; port ADC_DB10_P
ADC_DB12_N: U21.10(DB12M) ; port ADC_DB12_N
ADC_DB12_P: U21.11(DB12P) ; port ADC_DB12_P
ADC_Reset: U21.12(RESET) ; port ADC_Reset
ADC_SCLK: U21.13(SCLK) ; port ADC_SCLK
ADC_SDATA: U21.14(SDATA) ; port ADC_SDATA
ADC_SDOUT: U21.64(SDOUT) ; port ADC_SDOUT
ADC_SEN: U21.15(SEN) ; port ADC_SEN
NetC182_1: C182.1 U21.25(CLKP)
NetC183_1: C183.1 U21.26(CLKM)
NetC184_1: C184.1 R98.1 U21.29(INP_A)
NetC184_2: C184.2 R95.1 U21.30(INM_A)
NetC186_1: C186.1 R105.1 U21.19(INP_B)
NetC186_2: C186.2 R102.1 U21.20(INM_B)
NetJ4_1: J4.1 R94.2 R96.2
NetJ5_1: J5.1 R101.2 R103.2
NetL4_1: L4.1 U22.19(-OUT1)
NetL4_2: L4.2 R95.2
NetL5_1: L5.1 U22.18(+OUT1)
NetL5_2: L5.2 R98.2
NetL6_1: L6.1 U22.13(-OUT2)
NetL6_2: L6.2 R102.2
NetL7_1: L7.1 U22.12(+OUT2)
NetL7_2: L7.2 R105.2
NetR93_1: R93.1 U22.23(-FB1)
NetR93_2: R93.2 R94.1 U22.24(+IN1)
NetR97_1: R97.1 R99.2 U22.1(-IN1)
NetR99_1: R99.1 U22.2(+FB1)
NetR100_1: R100.1 U22.5(-FB2)
NetR100_2: R100.2 R101.1 U22.6(+IN2)
NetR104_1: R104.1 R106.2 U22.7(-IN2)
NetR106_1: R106.1 U22.8(+FB2)

Not connected (* = marked no-connect by the designer): U21 22(NC)*

### Layout directives
differential pair: 200M_CLK_N, 200M_CLK_P, ADC_CLKOUT_N, ADC_CLKOUT_P, ADC_DA0_N, ADC_DA0_P, ADC_DA2_N, ADC_DA2_P, ADC_DA4_N, ADC_DA4_P, ADC_DA6_N, ADC_DA6_P, ADC_DA8_N, ADC_DA8_P, ADC_DA10_N, ADC_DA10_P, ADC_DA12_N, ADC_DA12_P, ADC_DB0_N, ADC_DB0_P, ADC_DB2_N, ADC_DB2_P, ADC_DB4_N, ADC_DB4_P, ADC_DB6_N, ADC_DB6_P, ADC_DB8_N, ADC_DB8_P, ADC_DB10_N, ADC_DB10_P, ADC_DB12_N, ADC_DB12_P

### Notes on the sheet
- (near R92) Topologie pour Clock LVDS
- Internal Pull-up
- (near U21) SDATA, SCLK, RESET, CTRL1, CTRL2, and CTRL3 have an internal 100-kΩ pull-down resistor.
- Sheet POWER
  ADC
  320 mA  (3V3A)
  165 mA (1V8D)
  Ampli
  43.2 mA (5V)
  total :
  165 mA (1V8D)
  320 mA (3V3A)
  43.2 mA (5V)
- Filtre LC différentiel L1=L2
  fc ~ 1/2pi*sqrt(2LC)
  Pour 802.11, on veut transmettre 0-40 MHz. On pose fc = 50 MhZ
  L= 5 nH et C = 1nF
- 165 mA @ 1V8D
  320 mA @ 3V3A
  43.2 mA @ 5V
  43.2 mA @ -5V
- Sheet Name
- Project Title
- Global Project
- Size
- Group
- Revision
- Date
- Sheet
- of
- Filename
- Designers
- (in symbol ADC_ADS62P48IRGCT, part A) ADC
- (in symbol ADC_ADS62P48IRGCT, part B) ADC
- (in symbol CONN_SMA_5-1814400-1) SMA; RA

### Library data of the parts
C181-C183 C185 C188-C197 C200-C215 = CAP - 0402: Precision: 10%; Current: *; CreatedBy: Jonathan Bouchard; Power: *
C184 C186 = CAP - 0402: Mfg Part Number: GCM1555C1H102FA16D; Precision: 1%; Current: *; CreatedBy: Jonathan Bouchard; Power: *
C187 C198 C199 C216 = CAP - 0805: Precision: 10%; Current: *; CreatedBy: Jonathan Bouchard; Power: *
J4 J5 = CONN_SMA_5-1814400-1: CONN -  SMA JACK R/A 50 OHM - TH; Mfg: TE Connectivity AMP Connectors; Voltage: *; Current: *; Power: *; Mfg Part Number: 5-1814400-1; HelpURL: http://www.te.com/commerce/DocumentDelivery/DDEController?Action=srchrtrv&DocNm=1814400&DocType=Customer+Drawing&DocLang=English; CreatedBy: Jonathan Bouchard; Temperature: -55°C ~ 85°C; Value: *; Precision: *; Package: TH-5; Supplier 1: Digikey; Supplier Part Number 1: A97593-ND
L4-L7 = CMP-06042-006317-1: Wire Wound RF Inductor for Automotive 5.1nH ±0.2nH 800mA 0.051Ω 0402 (1005)
R92-R106 = RES - 0402: Voltage: 50V; Power: 1/16W; Current: *; CreatedBy: Jonathan Bouchard
U21 = ADC_ADS62P48IRGCT: ADC - 14 BIT 210MSPS SUAL - VQFN-64; Voltage: 3.15 V ~ 3.6 V / 1.7 V ~ 1.9 V; Mfg: Texas Instruments; Precision: 14 Bit; Current: *; Power: *; Mfg Part Number: ADS62P48IRGCT; HelpURL: http://www.ti.com/lit/ds/symlink/ads62p48.pdf; CreatedBy: Jonathan Bouchard; Temperature: -40°C ~ 85°C; Value: *; Package: VQFN-64; Supplier 1: Digikey; Supplier Part Number 1: 296-24611-1-ND
U22 = OPAMP_ADA4927-2YCPZ-R2: OPAMP - CFA 2.3GHZ - QFN-24; Voltage: 4.5 V ~ 11 V, ±2.25 V ~ 5.5 V; Current: 65mA; Mfg: Analog Devices; Power: *; Mfg Part Number: ADA4927-2YCPZ-R2; HelpURL: http://www.analog.com/media/en/technical-documentation/data-sheets/ADA4927-1_4927-2.pdf; CreatedBy: Jonathan Bouchard; Temperature: -40°C ~ 105°C; Value: *; Precision: *; Package: QFN-24; Supplier 1: Digikey; Supplier Part Number 1: ADA4927-2YCPZ-R2CT-ND
L8 = FER - 0402: Voltage: *; CreatedBy: Jonathan Bouchard; Power: *; Precision: *